# EAGLE design controller (EAGLE 6.1)
Test
DOC_ID: CLK-SCH-03; DOC_PART_NO: CLK-PC-03; DOC_REV: A; DOC_TITLE: CONTROLLER; PROJECT_NAME: ALARM CLOCK

## Sheet 1 of 4: CPU
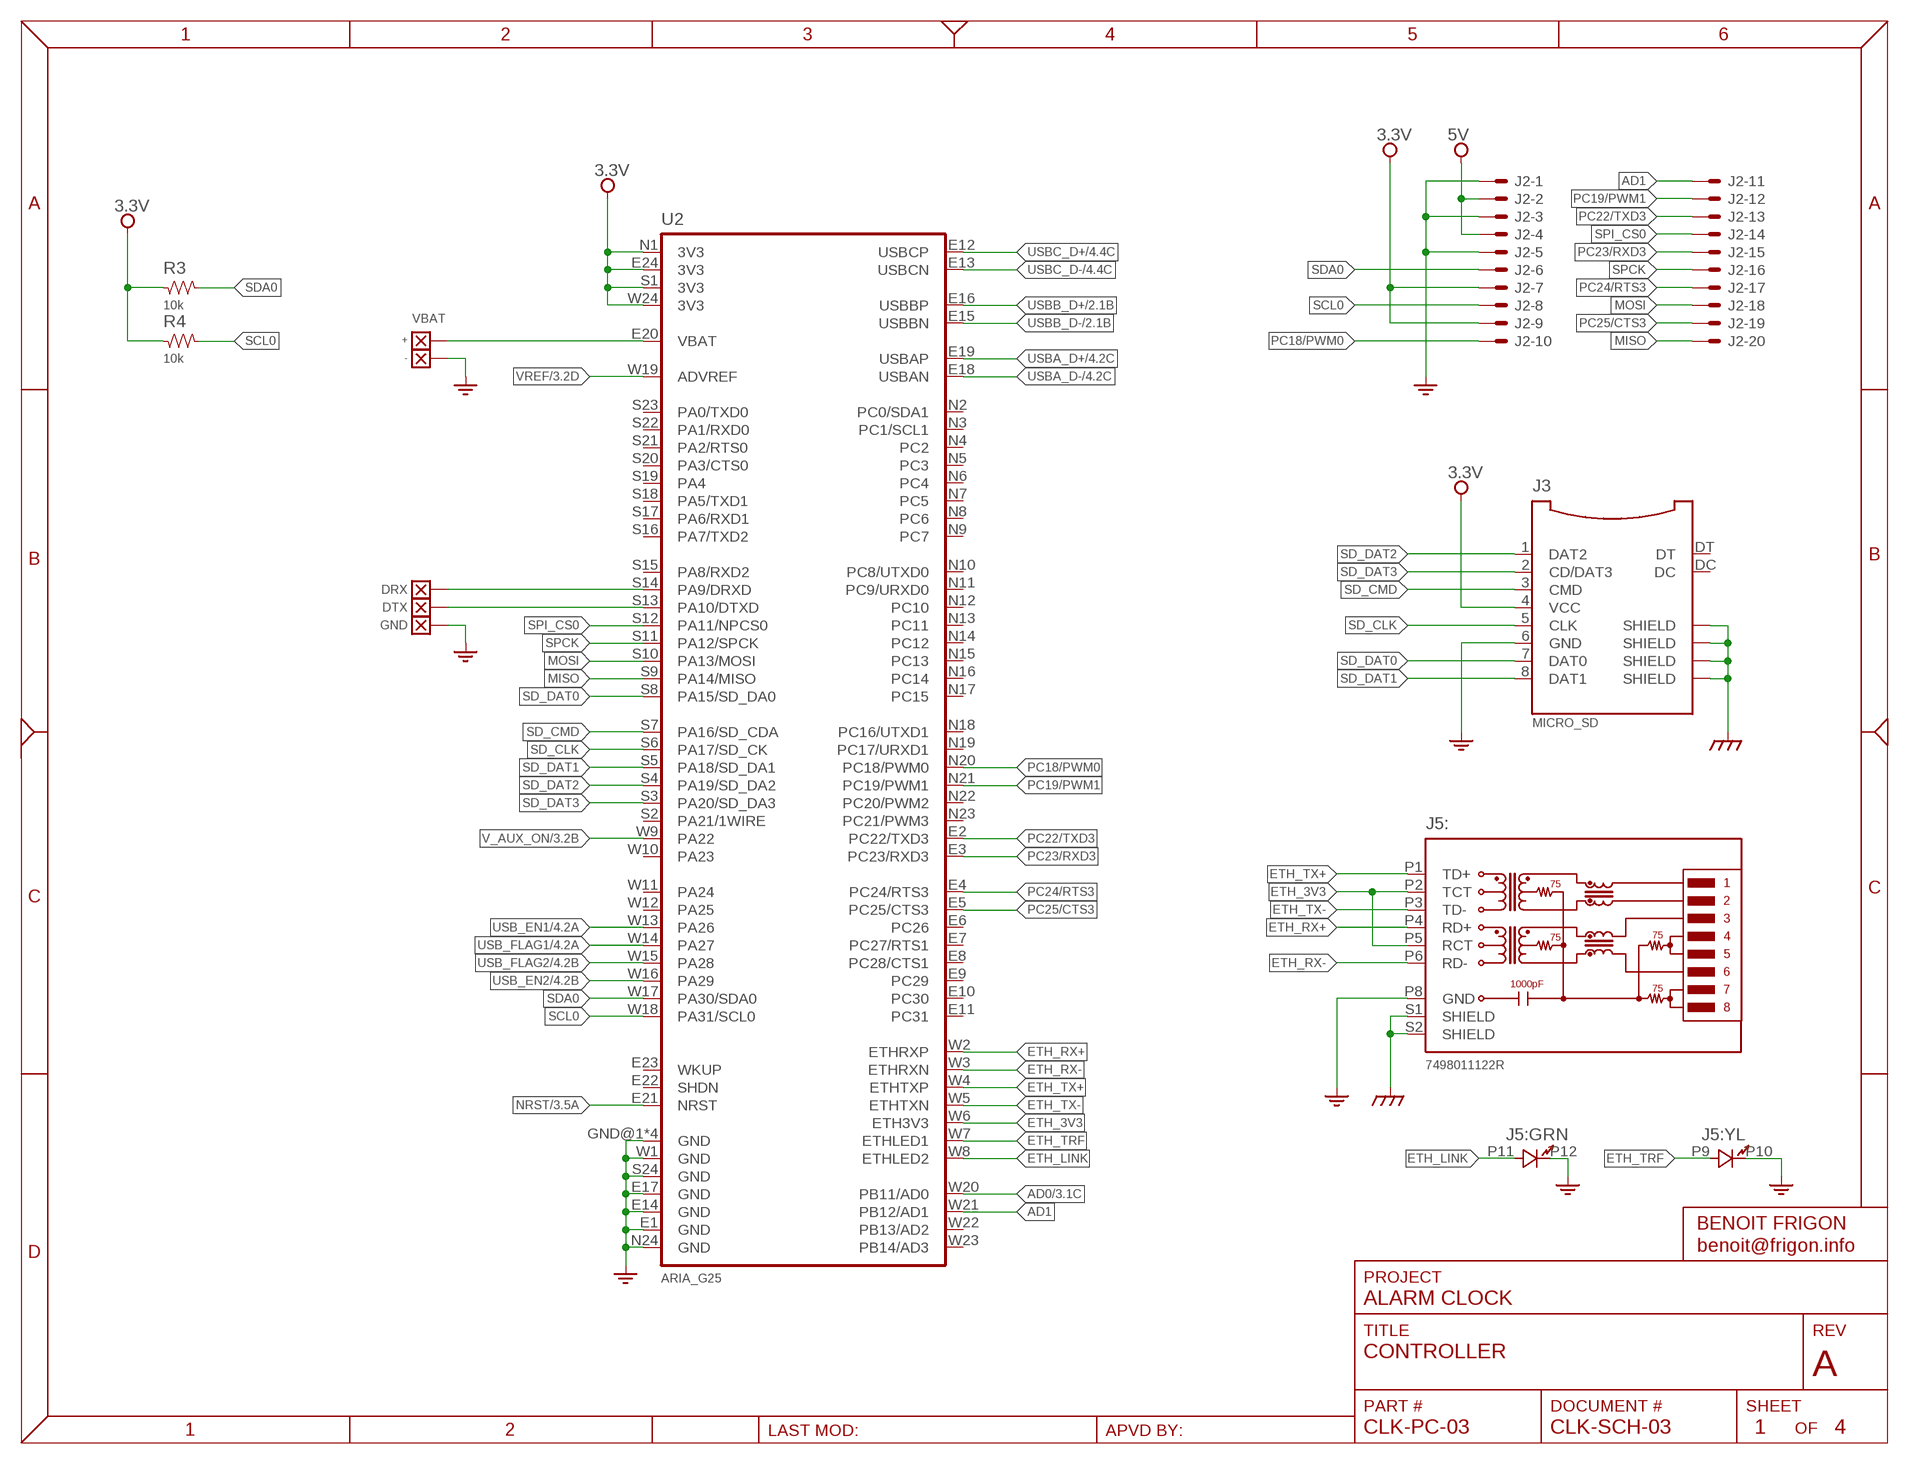
[diagram p0: schematic, sheet 1]

### Parts
J2  DL-1.25MM-HEADER-20  [DF13A-20DP-1.25]
J3  MICRO_SD  [5027020891]
J5  7498011122R  [7498011122R]
R3  10k  RES-0603  [SMD_0603]
R4  10k  RES-0603  [SMD_0603]
TP1  +  WIRE-150X75  [WIRE_SMT_150X75]
TP2  -  WIRE-150X75  [WIRE_SMT_150X75]
U2  ARIA_G25  [ARIA_G25]
W2  DRX  WIRE-150X75  [WIRE_SMT_150X75]
W3  DTX  WIRE-150X75  [WIRE_SMT_150X75]
W4  GND  WIRE-150X75  [WIRE_SMT_150X75]

### Nets
3.3V [Power]: J2.7 J2.9 J3.4(VCC) R3.1 R4.1 U2.E24(3V3) U2.N1(3V3) U2.S1(3V3) U2.W24(3V3) ; also sheet 3,4
5V [Power]: J2.2 J2.4 ; also sheet 2,3,4
AD0: U2.W20(PB11/AD0) ; also sheet 3
AD1: J2.11 U2.W21(PB12/AD1)
DRX: U2.S14(PA9/DRXD) W2.1
DTX: U2.S13(PA10/DTXD) W3.1
EARTH: J3.SHDL@3(SHIELD) J3.SHLD@1(SHIELD) J3.SHLD@2(SHIELD) J3.SHLD@4(SHIELD) J5.S1(::SHIELD) J5.S2(::SHIELD) ; also sheet 3,4
ETH_3V3: J5.P2(::TCT) J5.P5(::RCT) U2.W6(ETH3V3)
ETH_LINK: J5.P11(:GRN:A) U2.W8(ETHLED2)
ETH_RX+: J5.P4(::RD+) U2.W2(ETHRXP)
ETH_RX-: J5.P6(::RD-) U2.W3(ETHRXN)
ETH_TRF: J5.P9(:YL:A) U2.W7(ETHLED1)
ETH_TX+: J5.P1(::TD+) U2.W4(ETHTXP)
ETH_TX-: J5.P3(::TD-) U2.W5(ETHTXN)
GND: J2.1 J2.3 J2.5 J3.6(GND) J5.P8(::GND) J5.P10(:YL:K) J5.P12(:GRN:K) TP2.1 U2.E1(GND) U2.E14(GND) U2.E17(GND) U2.GND@1(GND) U2.GND@2(GND) U2.GND@3(GND) U2.GND@4(GND) U2.N24(GND) U2.S24(GND) U2.W1(GND) W4.1 ; also sheet 2,3,4
MISO: J2.20 U2.S9(PA14/MISO)
MOSI: J2.18 U2.S10(PA13/MOSI)
N$1: TP1.1 U2.E20(VBAT)
NRST: U2.E21(NRST) ; also sheet 3
PC18/PWM0: J2.10 U2.N20(PC18/PWM0)
PC19/PWM1: J2.12 U2.N21(PC19/PWM1)
PC22/TXD3: J2.13 U2.E2(PC22/TXD3)
PC23/RXD3: J2.15 U2.E3(PC23/RXD3)
PC24/RTS3: J2.17 U2.E4(PC24/RTS3)
PC25/CTS3: J2.19 U2.E5(PC25/CTS3)
SCL0: J2.8 R4.2 U2.W18(PA31/SCL0)
SD_CLK: J3.5(CLK) U2.S6(PA17/SD_CK)
SD_CMD: J3.3(CMD) U2.S7(PA16/SD_CDA)
SD_DAT0: J3.7(DAT0) U2.S8(PA15/SD_DA0)
SD_DAT1: J3.8(DAT1) U2.S5(PA18/SD_DA1)
SD_DAT2: J3.1(DAT2) U2.S4(PA19/SD_DA2)
SD_DAT3: J3.2(CD/DAT3) U2.S3(PA20/SD_DA3)
SDA0: J2.6 R3.2 U2.W17(PA30/SDA0)
SPCK: J2.16 U2.S11(PA12/SPCK)
SPI_CS0: J2.14 U2.S12(PA11/NPCS0)
USB_EN1: U2.W13(PA26) ; also sheet 4
USB_EN2: U2.W16(PA29) ; also sheet 4
USB_FLAG1: U2.W14(PA27) ; also sheet 4
USB_FLAG2: U2.W15(PA28) ; also sheet 4
USBA_D+: U2.E19(USBAP) ; also sheet 4
USBA_D-: U2.E18(USBAN) ; also sheet 4
USBB_D+: U2.E16(USBBP) ; also sheet 2
USBB_D-: U2.E15(USBBN) ; also sheet 2
USBC_D+: U2.E12(USBCP) ; also sheet 4
USBC_D-: U2.E13(USBCN) ; also sheet 4
V_AUX_ON: U2.W9(PA22) ; also sheet 3
VREF: U2.W19(ADVREF) ; also sheet 3
Unconnected: J3.DC J3.DT U2.E6(PC26) U2.E7(PC27/RTS1) U2.E8(PC28/CTS1) U2.E9(PC29) U2.E10(PC30) U2.E11(PC31) U2.E22(SHDN) U2.E23(WKUP) U2.N2(PC0/SDA1) U2.N3(PC1/SCL1) U2.N4(PC2) U2.N5(PC3) U2.N6(PC4) U2.N7(PC5) U2.N8(PC6) U2.N9(PC7) U2.N10(PC8/UTXD0) U2.N11(PC9/URXD0) U2.N12(PC10) U2.N13(PC11) U2.N14(PC12) U2.N15(PC13) U2.N16(PC14) U2.N17(PC15) U2.N18(PC16/UTXD1) U2.N19(PC17/URXD1) U2.N22(PC20/PWM2) U2.N23(PC21/PWM3) U2.S2(PA21/1WIRE) U2.S15(PA8/RXD2) U2.S16(PA7/TXD2) U2.S17(PA6/RXD1) U2.S18(PA5/TXD1) U2.S19(PA4) U2.S20(PA3/CTS0) U2.S21(PA2/RTS0) U2.S22(PA1/RXD0) U2.S23(PA0/TXD0) U2.W10(PA23) U2.W11(PA24) U2.W12(PA25) U2.W22(PB13/AD2) U2.W23(PB14/AD3)

### Notes on the sheet
- VBAT

## Sheet 2 of 4: Audio
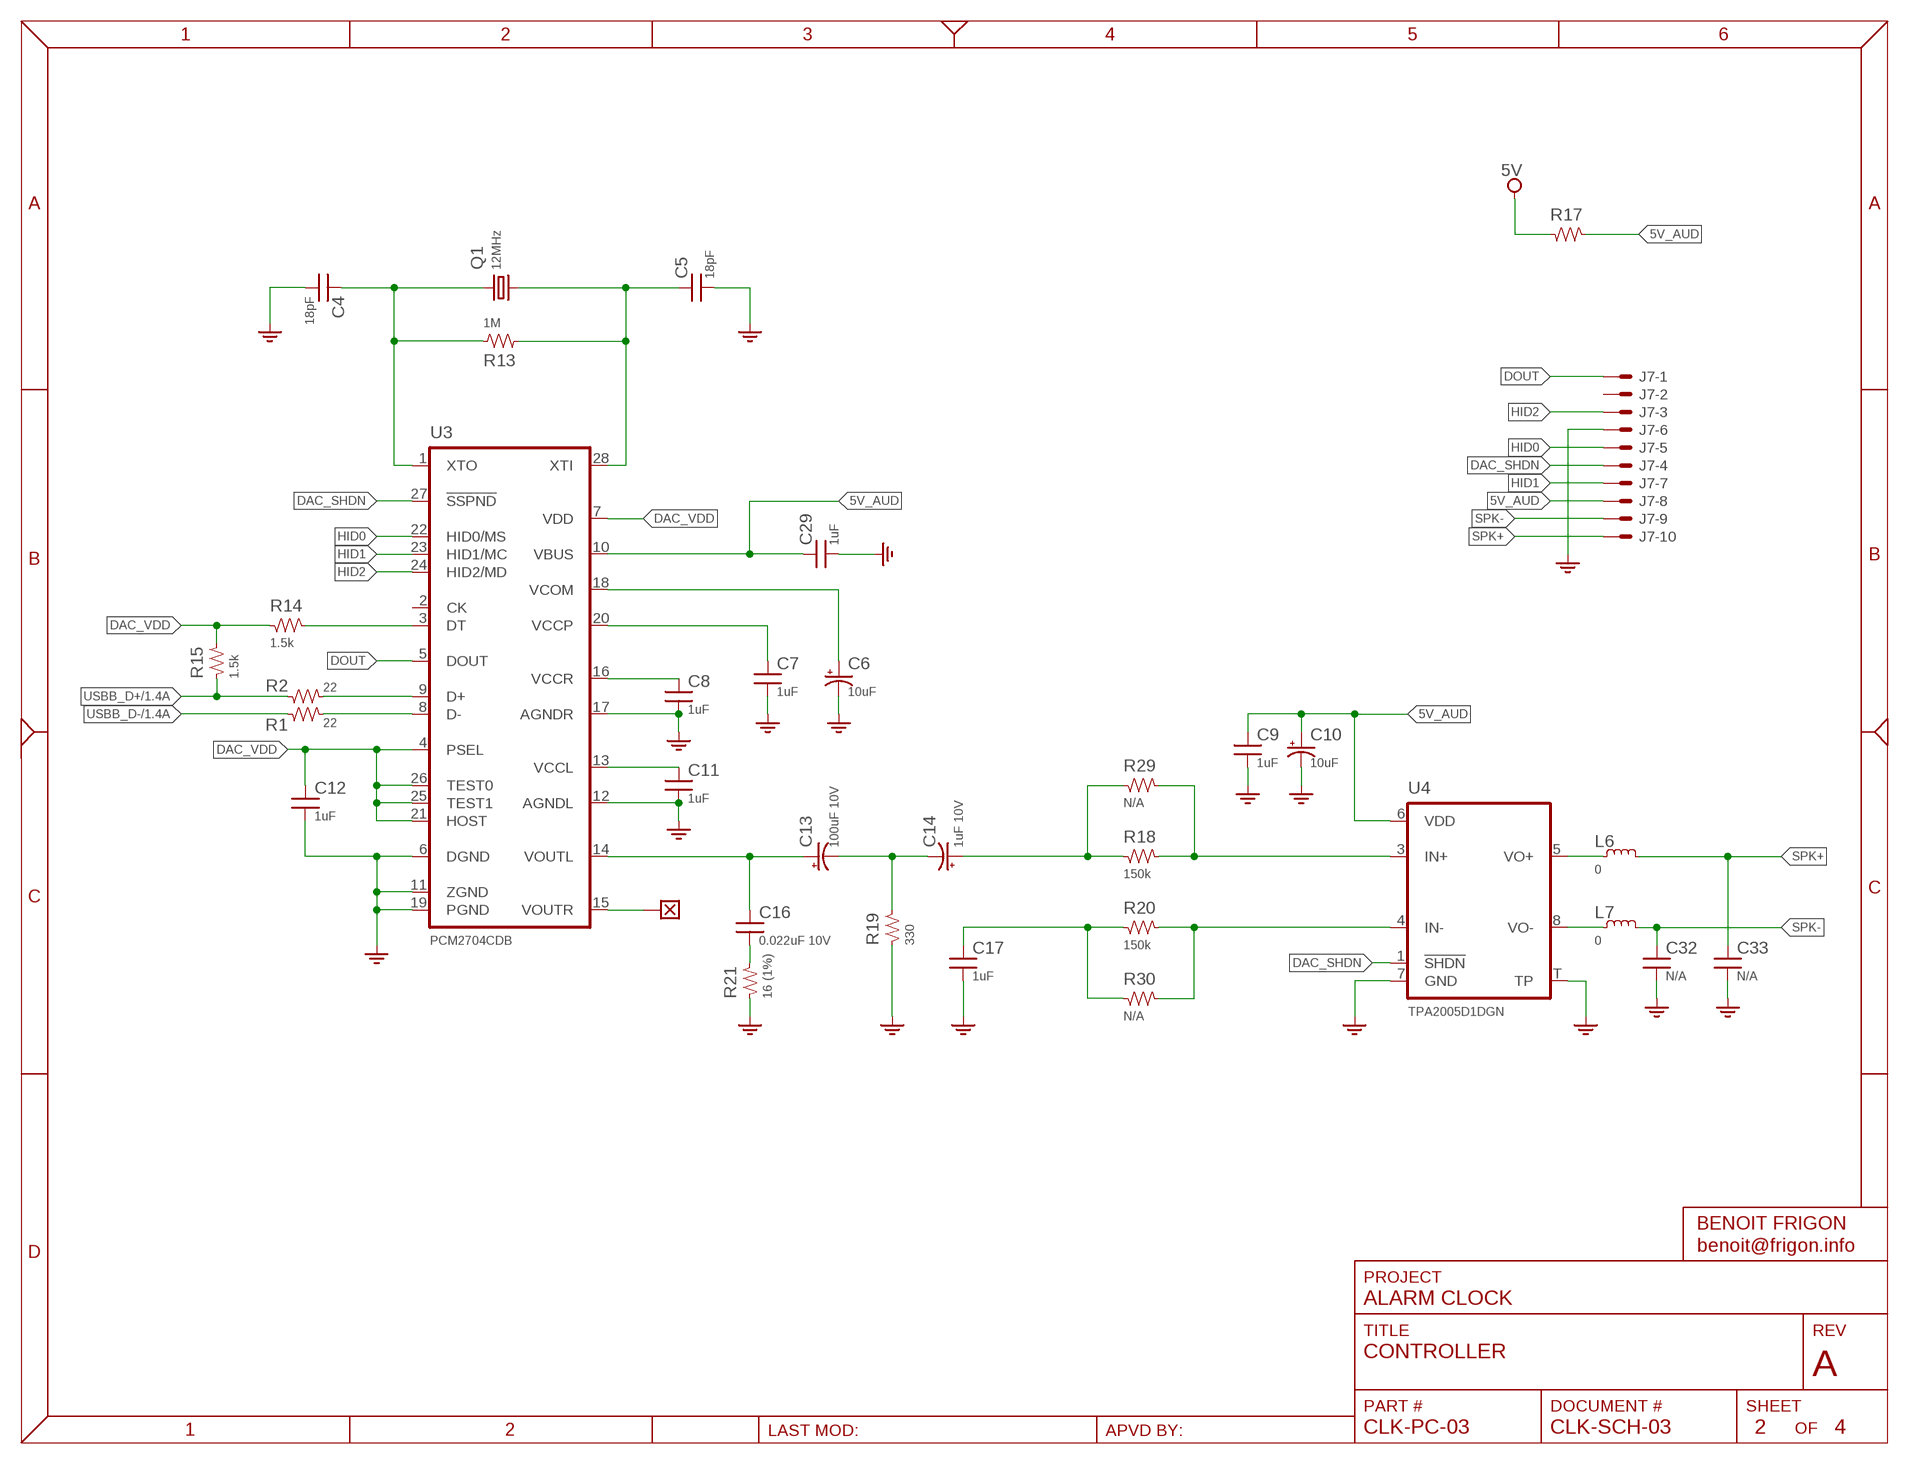
[diagram p1: schematic, sheet 2]
FRAME2 (FRAME_LETTER): SUBTITLE: AUDIO

### Parts
C4  18pF  CAP-0603  [SMD_0603]
C5  18pF  CAP-0603  [SMD_0603]
C6  10uF  CAP-E-0805-ALUM  [CAP_S0805]
C7  1uF  CAP-0603  [SMD_0603]
C8  1uF  CAP-0603  [SMD_0603]
C9  1uF  CAP-0603  [SMD_0603]
C10  10uF  CAP-E-0805-ALUM  [CAP_S0805]
C11  1uF  CAP-0603  [SMD_0603]
C12  1uF  CAP-0603  [SMD_0603]
C13  100uF 10V  CAP-E-1210-ALUM  [CAP_S1210]
C14  1uF 10V  CAP-E-0805-ALUM  [CAP_S0805]
C16  0.022uF 10V  CAP-0603  [SMD_0603]
C17  1uF  CAP-0603  [SMD_0603]
C29  1uF  CAP-0603  [SMD_0603]
C32  N/A  CAP-0603  [SMD_0603]
C33  N/A  CAP-0603  [SMD_0603]
J7  DL-1.25MM-HEADER-10  [DF13A-10DP-1.25]
L6  0  IND-0603  [SMD_0603]
L7  0  IND-0603  [SMD_0603]
Q1  12MHz  XTALHC49UP  [HC49UP]
R1  22  RES-0603  [SMD_0603]
R2  22  RES-0603  [SMD_0603]
R13  1M  RES-0603  [SMD_0603]
R14  1.5k  RES-0603  [SMD_0603]
R15  1.5k  RES-0603  [SMD_0603]
R17  RES-1206  [SMD_1206]
R18  150k  RES-0603  [SMD_0603]
R19  330  RES-0603  [SMD_0603]
R20  150k  RES-0603  [SMD_0603]
R21  16 (1%)  RES-0603  [SMD_0603]
R29  N/A  RES-0603  [SMD_0603]
R30  N/A  RES-0603  [SMD_0603]
U3  PCM2704CDB  [SSOP28]
U4  TPA2005D1DGN  [PPSOP8]
W1  WIRE-150X75  [WIRE_SMT_150X75]

### Nets
5V [Power]: R17.1 ; also sheet 1,3,4
5V_AUD: C9.1 C10.+ C29.1 J7.8 R17.2 U3.10(VBUS) U4.6(VDD)
DAC_SHDN: J7.4 U3.27(!SSPND) U4.1(!SHDN)
DAC_VDD: C12.1 R14.1 R15.2 U3.4(PSEL) U3.7(VDD) U3.21(HOST) U3.25(TEST1) U3.26(TEST0)
DOUT: J7.1 U3.5(DOUT)
GND: C4.2 C5.2 C6.- C7.2 C8.2 C9.2 C10.- C11.2 C12.2 C17.2 C29.2 C32.2 C33.2 J7.6 R19.1 R21.1 U3.6(DGND) U3.11(ZGND) U3.12(AGNDL) U3.17(AGNDR) U3.19(PGND) U4.7(GND) U4.T(TP) ; also sheet 1,3,4
HID0: J7.5 U3.22(HID0/MS)
HID1: J7.7 U3.23(HID1/MC)
HID2: J7.3 U3.24(HID2/MD)
N$12: R2.2 U3.9(D+)
N$13: R1.2 U3.8(D-)
N$14: C11.1 U3.13(VCCL)
N$15: C6.+ U3.18(VCOM)
N$16: C7.1 U3.20(VCCP)
N$17: C8.1 U3.16(VCCR)
N$18: C14.+ R18.1 R29.1
N$19: R14.2 U3.3(DT)
N$20: U3.15(VOUTR) W1.1
N$24: L6.1 U4.5(VO+)
N$25: L7.1 U4.8(VO-)
N$26: R18.2 R29.2 U4.3(IN+)
N$27: R20.2 R30.2 U4.4(IN-)
N$28: C17.1 R20.1 R30.1
N$29: C13.- C14.- R19.2
N$31: C16.2 R21.2
SPK+: C33.1 J7.10 L6.2
SPK-: C32.1 J7.9 L7.2
USBB_D+: R2.1 R15.1 ; also sheet 1
USBB_D-: R1.1 ; also sheet 1
VOUTL: C13.+ C16.1 U3.14(VOUTL)
XTI: C5.1 Q1.2 R13.2 U3.28(XTI)
XTO: C4.1 Q1.1 R13.1 U3.1(XTO)
Unconnected: J7.2 U3.2(CK)

## Sheet 3 of 4: Power supply
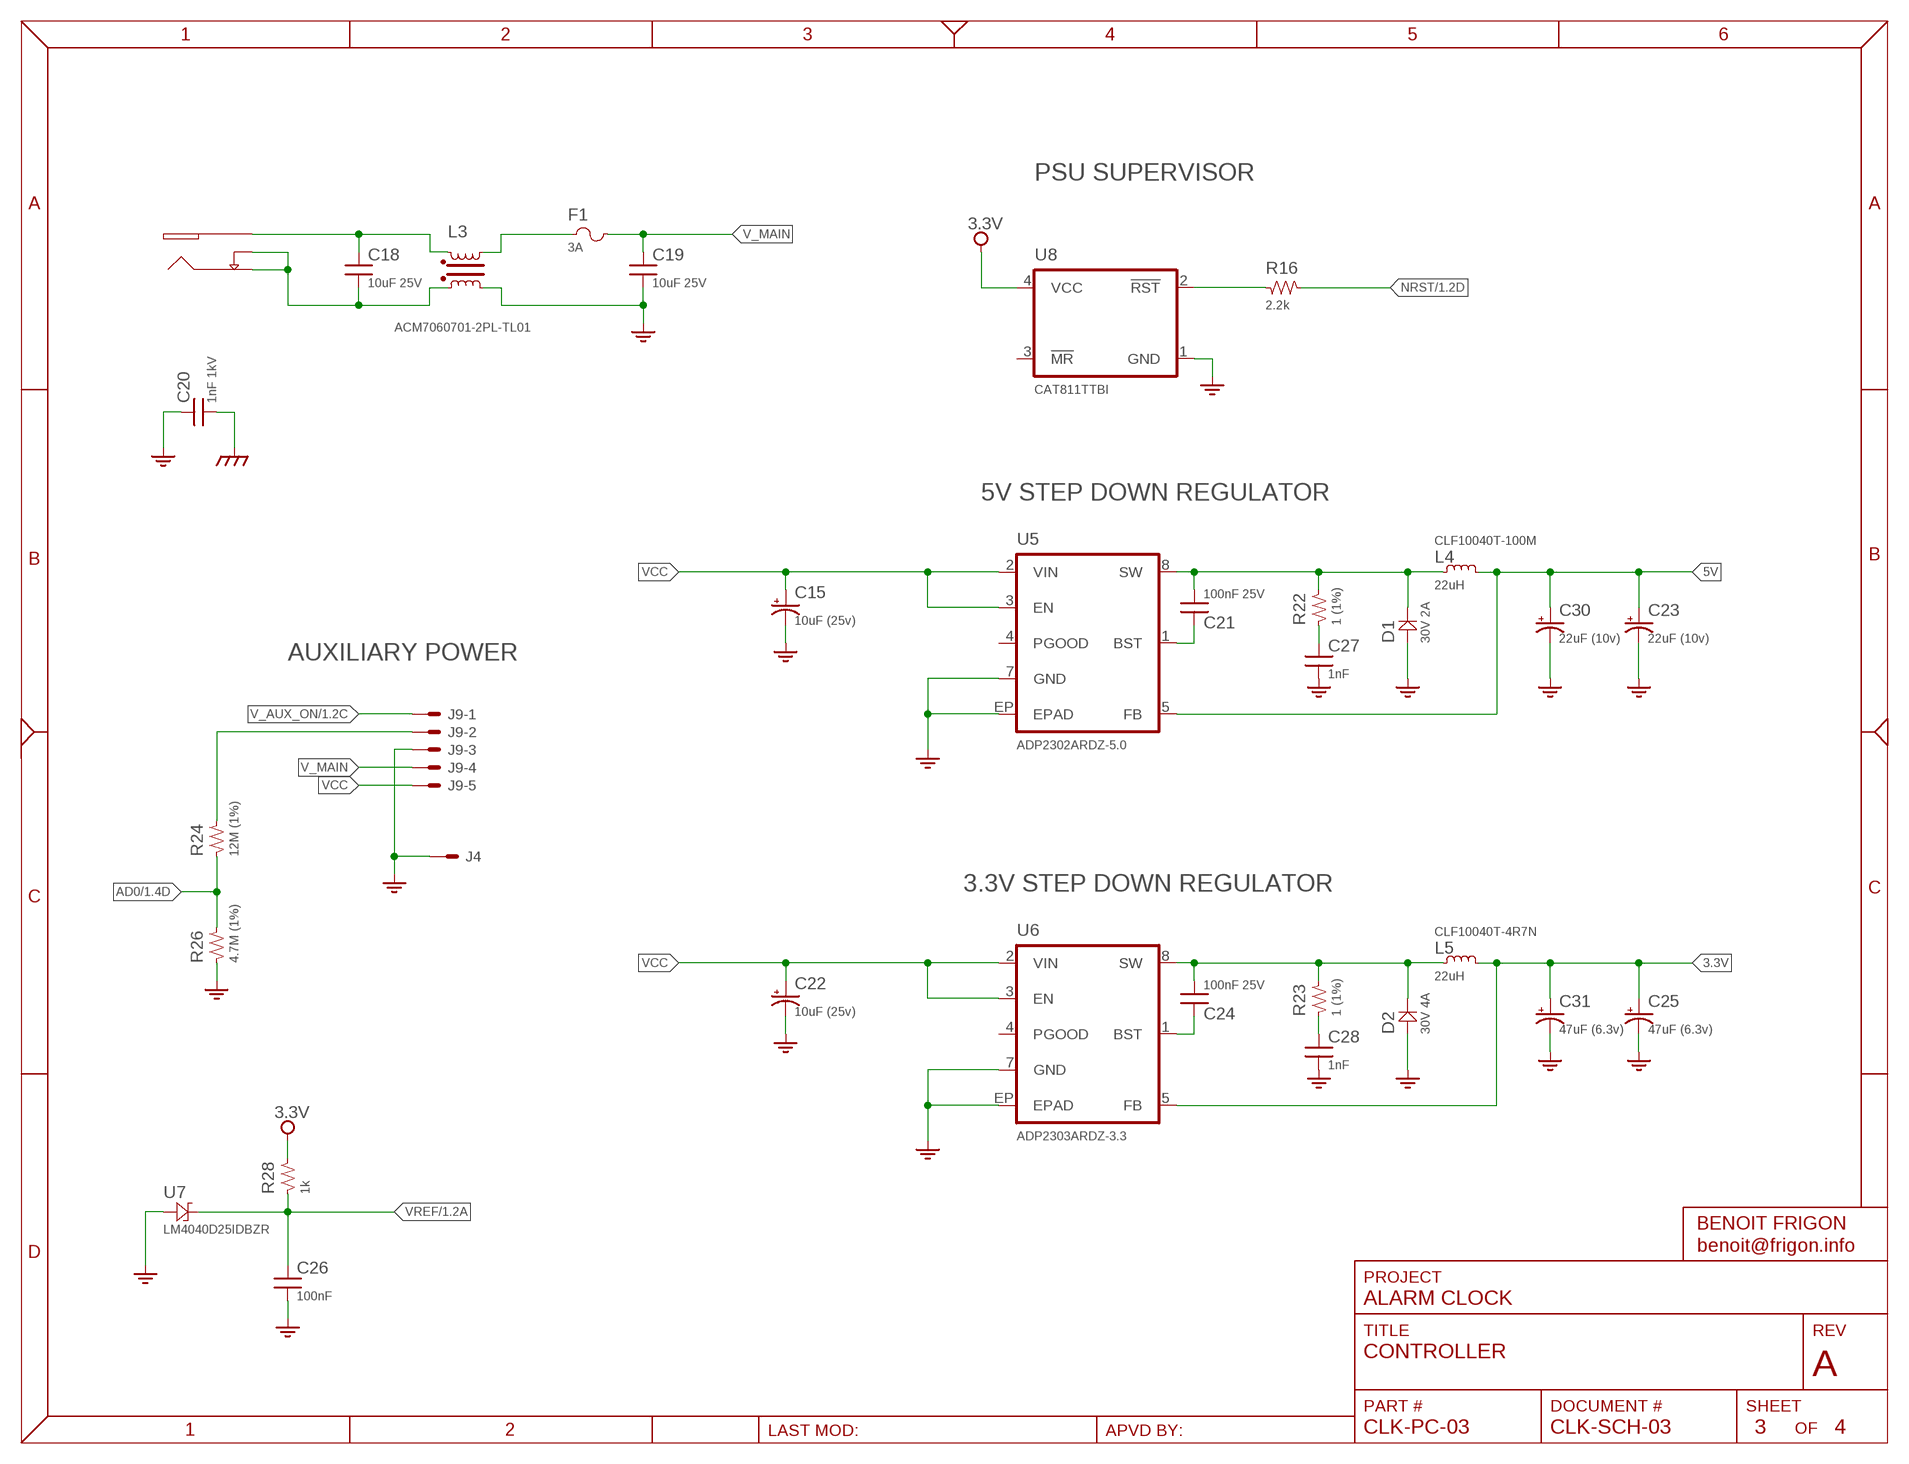
[diagram p2: schematic, sheet 3]
FRAME3 (FRAME_LETTER): SUBTITLE: POWER SUPPLY

### Parts
C15  10uF (25v)  CAP-E-1210-TANT  [CAP_S1210]
C18  10uF 25V  CAP-1206  [SMD_1206]
C19  10uF 25V  CAP-1206  [SMD_1206]
C20  1nF 1kV  CAP-0805  [SMD_0805]
C21  100nF 25V  CAP-0603  [SMD_0603]
C22  10uF (25v)  CAP-E-1210-TANT  [CAP_S1210]
C23  22uF (10v)  CAP-E-1206-TANT  [CAP_S1206]
C24  100nF 25V  CAP-0603  [SMD_0603]
C25  47uF (6.3v)  CAP-E-1206-TANT  [CAP_S1206]
C26  100nF  CAP-0603  [SMD_0603]
C27  1nF  CAP-0805  [SMD_0805]
C28  1nF  CAP-0805  [SMD_0805]
C30  22uF (10v)  CAP-E-1206-TANT  [CAP_S1206]
C31  47uF (6.3v)  CAP-E-1206-TANT  [CAP_S1206]
D1  30V 2A  DIODE-DO214-AA  [DIODE_DO214-AA]
D2  30V 4A  DIODE-DO214-AA  [DIODE_DO214-AA]
F1  3A  FUSE1206  [SMD_1206]
J4  SNG-100-HEADER-01-HDR-V  [HDR_M_1]
J8  CUI-PJ-013C  [CUI-PJ-013C]
J9  SNG-100-HEADER-05-HDR-V  [HDR_M_5]
L3  ACM7060701-2PL-TL01  CHOKE-ACM7060701-2PL-TL01  [ACM7060]
L4  22uH  IND-10X10  [IND-10X10]
L5  22uH  IND-10X10  [IND-10X10]
R16  2.2k  RES-0603  [SMD_0603]
R22  1 (1%)  RES-0805  [SMD_0805]
R23  1 (1%)  RES-0805  [SMD_0805]
R24  12M (1%)  RES-0603  [SMD_0603]
R26  4.7M (1%)  RES-0603  [SMD_0603]
R28  1k  RES-0603  [SMD_0603]
U5  ADP2302ARDZ-5.0  [SOIC8-EP]
U6  ADP2303ARDZ-3.3  [SOIC8-EP]
U7  LM4040D25IDBZR  TS4040D30IDBZ  [SOT23]
U8  CAT811TTBI  [SOT143]

### Nets
3.3V [Power]: C25.+ C31.+ L5.2 R28.2 U6.5(FB) U8.4(VCC) ; also sheet 1,4
5V [Power]: C23.+ C30.+ L4.2 U5.5(FB) ; also sheet 1,2,4
AD0: R24.1 R26.2 ; also sheet 1
EARTH: C20.2 ; also sheet 1,4
GND: C15.- C19.2 C20.1 C22.- C23.- C25.- C26.2 C27.2 C28.2 C30.- C31.- D1.A D2.A J4.1(S) J9.3 L3.OA R26.1 U5.7(GND) U5.EP(EPAD) U6.7(GND) U6.EP(EPAD) U7.2(A) U8.1(GND) ; also sheet 1,2,4
IN_GND: C18.2 J8.2(GND) J8.3(SW) L3.IA
N$2: C27.1 R22.1
N$3: C28.1 R23.1
N$4: C18.1 J8.1(V+) L3.IB
N$11: C21.1 U5.1(BST)
N$21: R16.1 U8.2(!RST)
N$32: F1.1 L3.OB
N$36: C24.1 U6.1(BST)
NRST: R16.2 ; also sheet 1
SW_3.3: C24.2 D2.K L5.1 R23.2 U6.8(SW)
SW_5V: C21.2 D1.K L4.1 R22.2 U5.8(SW)
V_AUX_MON: J9.2 R24.2
V_AUX_ON: J9.1 ; also sheet 1
V_MAIN: C19.1 F1.2 J9.4
VCC: C15.+ C22.+ J9.5 U5.2(VIN) U5.3(EN) U6.2(VIN) U6.3(EN)
VREF: C26.1 R28.1 U7.1(K) ; also sheet 1
Unconnected: U5.4(PGOOD) U6.4(PGOOD) U8.3(!MR)

### Notes on the sheet
- PSU SUPERVISOR
- 5V STEP DOWN REGULATOR
- AUXILIARY POWER
- 3.3V STEP DOWN REGULATOR

## Sheet 4 of 4: USB
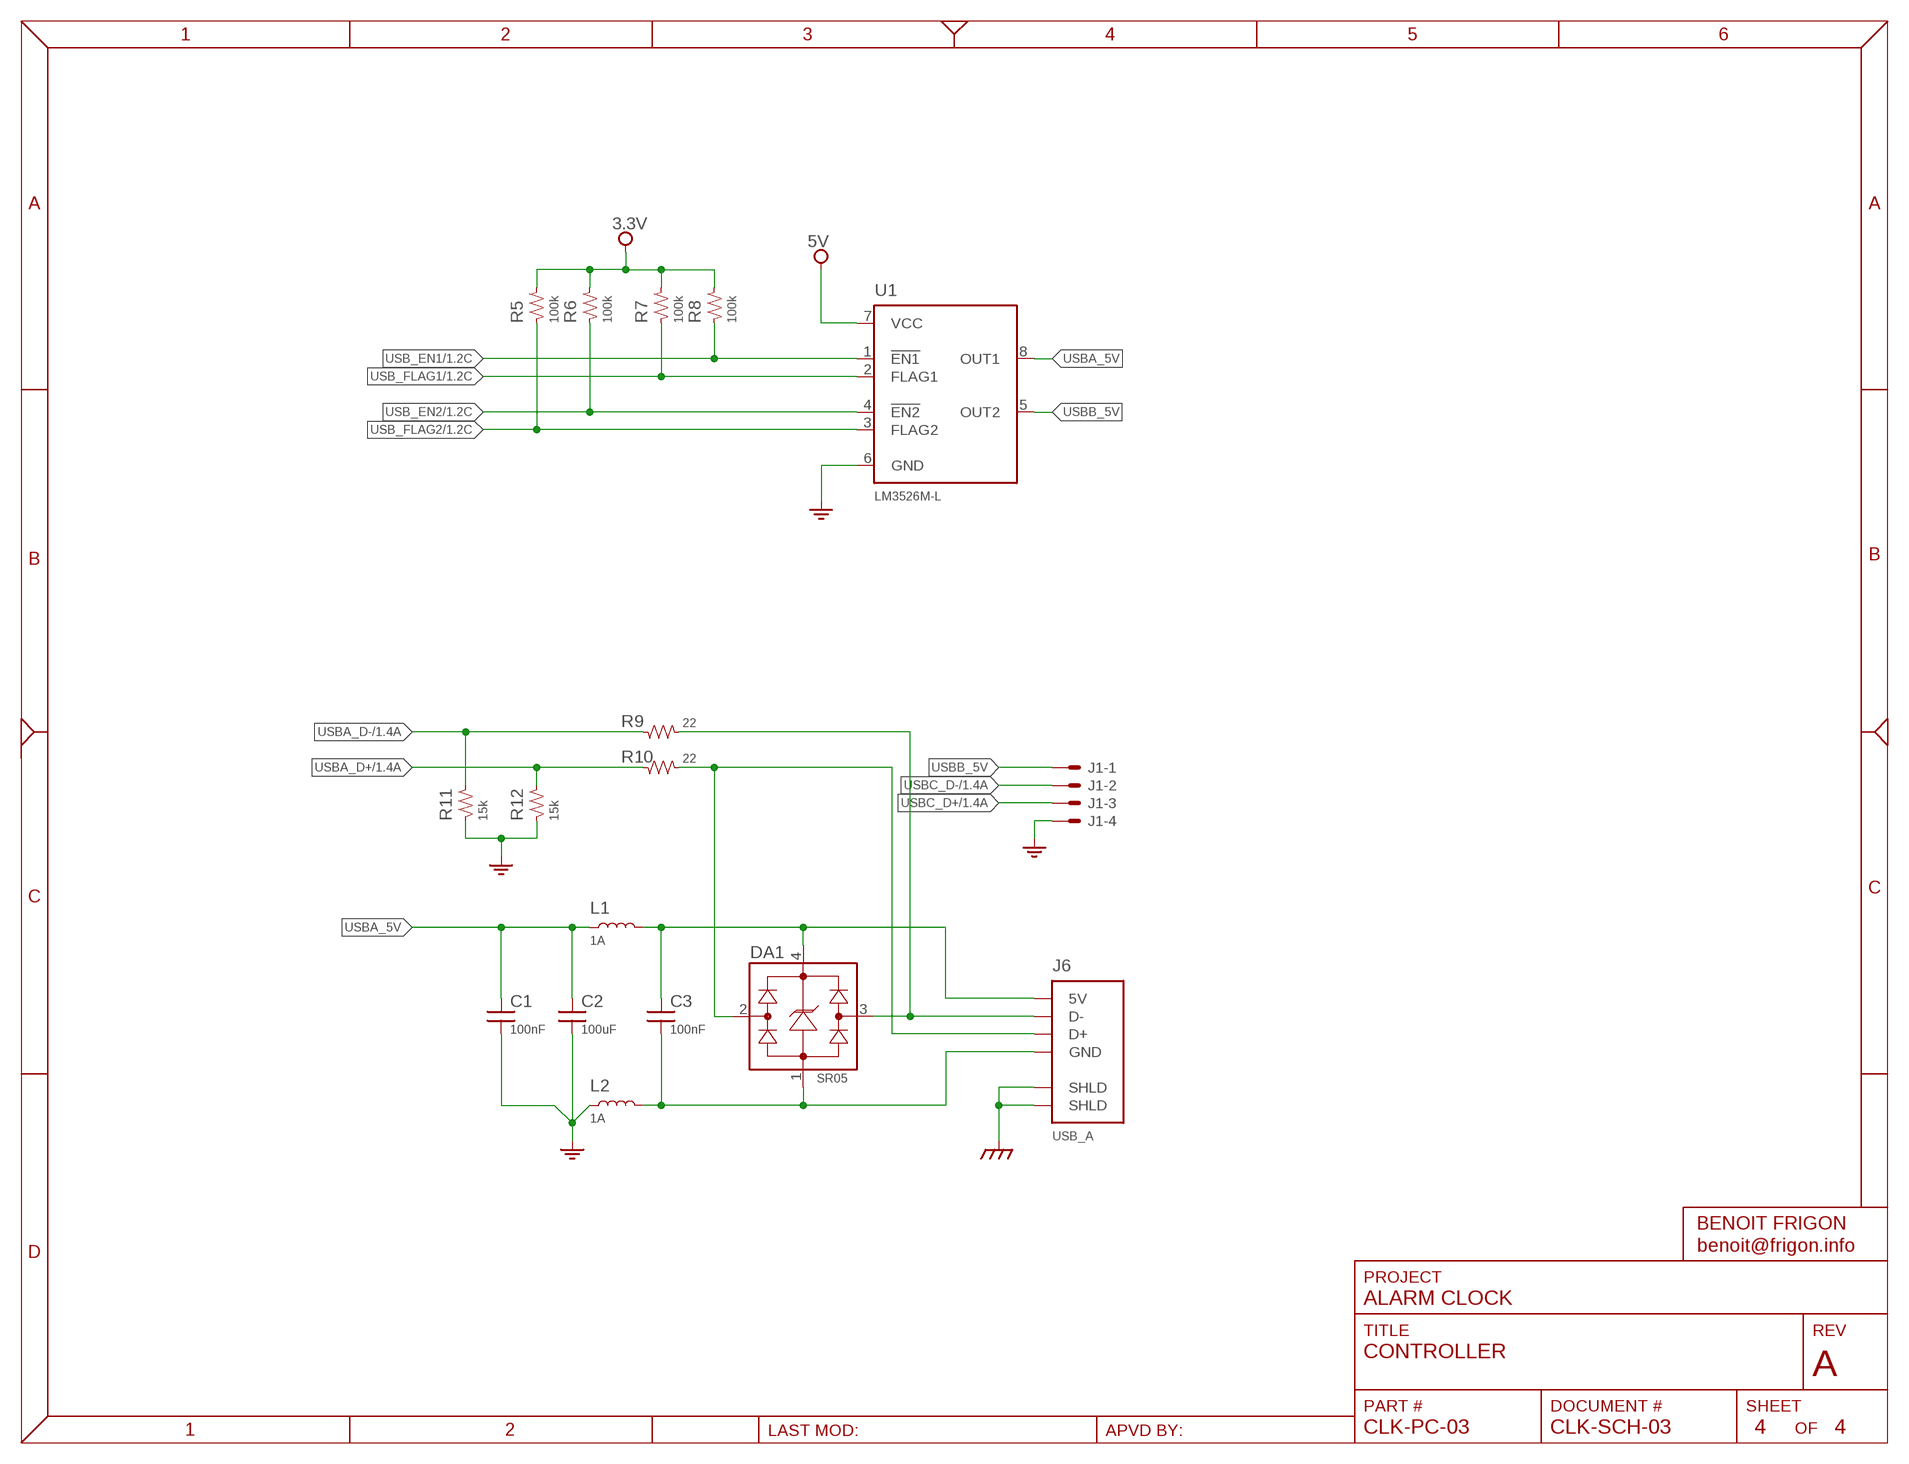
[diagram p3: schematic, sheet 4]

### Parts
C1  100nF  CAP-0603  [SMD_0603]
C2  100uF  CAP-0805  [SMD_0805]
C3  100nF  CAP-0603  [SMD_0603]
DA1  SR05  [SOT143]
J1  SNG-2MM-HEADER-04-V  [DF3X-4P-2DSA]
J6  USB_A  [292303-7]
L1  1A  FERRITE  [SMD_0805]
L2  1A  FERRITE  [SMD_0805]
R5  100k  RES-0603  [SMD_0603]
R6  100k  RES-0603  [SMD_0603]
R7  100k  RES-0603  [SMD_0603]
R8  100k  RES-0603  [SMD_0603]
R9  22  RES-0603  [SMD_0603]
R10  22  RES-0603  [SMD_0603]
R11  15k  RES-0603  [SMD_0603]
R12  15k  RES-0603  [SMD_0603]
U1  LM3526M-L  [SOIC8]

### Nets
3.3V [Power]: R5.2 R6.2 R7.2 R8.2 ; also sheet 1,3
5V [Power]: U1.7(VCC) ; also sheet 1,2,3
EARTH: J6.SHLD@1(SHLD) J6.SHLD@2(SHLD) ; also sheet 1,3
GND: C1.2 C2.2 J1.4 L2.1 R11.1 R12.1 U1.6(GND) ; also sheet 1,2,3
N$5: C3.1 DA1.4 J6.1(5V) L1.2
N$6: C3.2 DA1.1 J6.4(GND) L2.2
N$7: DA1.3 J6.2(D-) R9.2
N$8: DA1.2 J6.3(D+) R10.2
USB_EN1: R8.1 U1.1(!EN1) ; also sheet 1
USB_EN2: R6.1 U1.4(!EN2) ; also sheet 1
USB_FLAG1: R7.1 U1.2(FLAG1) ; also sheet 1
USB_FLAG2: R5.1 U1.3(FLAG2) ; also sheet 1
USBA_5V: C1.1 C2.1 L1.1 U1.8(OUT1)
USBA_D+: R10.1 R12.2 ; also sheet 1
USBA_D-: R9.1 R11.2 ; also sheet 1
USBB_5V: J1.1 U1.5(OUT2)
USBC_D+: J1.3 ; also sheet 1
USBC_D-: J1.2 ; also sheet 1

## Library data of the parts
C1 C3-C5 C7-C9 C11 C12 C16 C17 C21 C24 C26 C29 C32 C33 = Passive:CAP: Capacitor; DESCRIPTION: {DESCRIPTION} - SMT 0603 - {value}; PACKAGE: SMT 0603
C2 C20 C27 C28 = Passive:CAP: Capacitor; DESCRIPTION: {DESCRIPTION} - SMT 0805 - {value}; PACKAGE: SMT 0805
C6 C10 C14 = Passive:CAP-E-?-*: Capacitor; DESCRIPTION: Aluminium capacitor - SMT 0805 - {VALUE}
C13 = Passive:CAP-E-?-*: Capacitor; DESCRIPTION: Aluminium capacitor - SMT 1210 - {VALUE}; MFG: AVX
C15 C22 = Passive:CAP-E-?-*: Capacitor; DESCRIPTION: Tantalum capacitor - SMT 1210 - {VALUE}; MFG: AVX; PART_NO: TPSB106K025R1800
C18 C19 = Passive:CAP: Capacitor; DESCRIPTION: {DESCRIPTION} - SMT 1206 - {value}; PACKAGE: SMT 1206
C23 C30 = Passive:CAP-E-?-*: Capacitor; DESCRIPTION: Tantalum capacitor - SMT 1206 - {VALUE}; MFG: AVX; PART_NO: TPSA226M010R0900
C25 C31 = Passive:CAP-E-?-*: Capacitor; DESCRIPTION: Tantalum capacitor - SMT 1206 - {VALUE}; MFG: AVX; PART_NO: TPSA476K006R0800
D1 D2 = Passive:DIODE: Diode
DA1 = Passive:SR05: TVS Array 2-Line - 5V; MFG: Semtech; SKU: SR05.TCT
F1 = Passive:FUSE: Fuse; DESCRIPTION: {DESCRIPTION} - SMT 1206 - {VALUE}
J1 = Connectors:SNG-2MM-HEADER-04: 2mm Single Row Header - 4 pos; DESCRIPTION: {DESCRIPTION} - Vertical; MFG: Hirose Electronic; SKU: DF3A-4P-2DSA
J2 = Connectors:DL-1.25MM-HEADER-20
J3 = Connectors:MICRO_SD
J4 = Connectors:SNG-100-HEADER-01: 1 Pos - 2.54mm header
J5 = Connectors:7498011122R
J6 = Connectors:USB_A
J7 = Connectors:DL-1.25MM-HEADER-10
J8 = Connectors:CUI-PJ-013C
J9 = Connectors:SNG-100-HEADER-05: 5 Pos - Single Row - 2.54mm header; DESCRIPTION: {DESCRIPTION} - Male - Vertical
L1 L2 = Passive:FERRITE: Ferrite; DESCRIPTION: {DESCRIPTION} - SMT 0805 - {VALUE}
L3 = Passive:CHOKE-?*: Common mode choke; DESCRIPTION: {DESCRIPTION} - 4A; SKU: ACM7060-701-2PL-TL01
L4 = Passive:IND?*: Inductor; DESCRIPTION: {DESCRIPTION} - SMT 10x10mm - {VALUE}; MFG: TDK; PART_NO: CLF10040T-100M
L5 = Passive:IND?*: Inductor; DESCRIPTION: {DESCRIPTION} - SMT 10x10mm - {VALUE}; PART_NO: CLF10040T-4R7N
L6 L7 = Passive:IND?*: Inductor; DESCRIPTION: {DESCRIPTION} - SMT 0603 - {VALUE}
Q1 = Crystal:XTAL: Crystal
R1-R16 R18-R21 R24 R26 R28-R30 = Passive:RES: Resistor; DESCRIPTION: {DESCRIPTION} - SMT 0603 - {VALUE}; PACKAGE: SMT 0603
R17 = Passive:RES: Resistor; DESCRIPTION: {DESCRIPTION} - SMT 1206 - {VALUE}; PACKAGE: SMT 1206
R22 R23 = Passive:RES: Resistor; DESCRIPTION: {DESCRIPTION} - SMT 0805 - {VALUE}; PACKAGE: SMT 0805
TP1 TP2 W1-W4 = Misc:WIRE-?: Wire solder pad; BOM: FALSE
U1 = Power:LM3526?-*: Dual Port USB Power Switch and Over-Current Protection Features Compatible with USB1.1 and USB 2.0 1 ms fault flag delay filters Hot-Plug events Smooth turn-on eliminates in-rush induced voltage drop UL recognized component: REF# 205202 1A nominal short circuit output current protects PC power supplies Thermal shutdown protects device in direct short condition 500mA minimum continuous load current Small SO-8 package minimizes board space 2.7V to 5.5V input voltage range 140 m? Max. switch resistance 1 ?A Max. standby current 200 ?A Max. operating current Under-voltage lockout (UVLO); DESCRIPTION: Dual Port USB Power Switch and Over-Current Protection (Active Low); MFG: National Semiconductors
U2 = IC:ARIA_G25: ARM SoM 400MHz
U3 = IC:PCM2704C
U4 = IC:TPA2005D1?
U5 = Power:ADP230?: Step-Down Regulator; DESCRIPTION: {DESCRIPTION} - 2A, 5V; MFG: Analog Devices
U6 = Power:ADP230?: Step-Down Regulator; DESCRIPTION: {DESCRIPTION} - 3A, 3.3v; MFG: Analog Devices
U7 = Passive:TS4040; PART_NO: LM4040D25IDBZR
U8 = IC:CAT811*?: Microprocessor power supply supervisor; DESCRIPTION: {DESCRIPTION} - 3.08V threshold; MFG: ON Semiconductors; THRESHOLD: 3.08V

## Net classes
1 Power: width 0.406 mm, drill 0.457 mm, clearance 0.203 mm

## Board
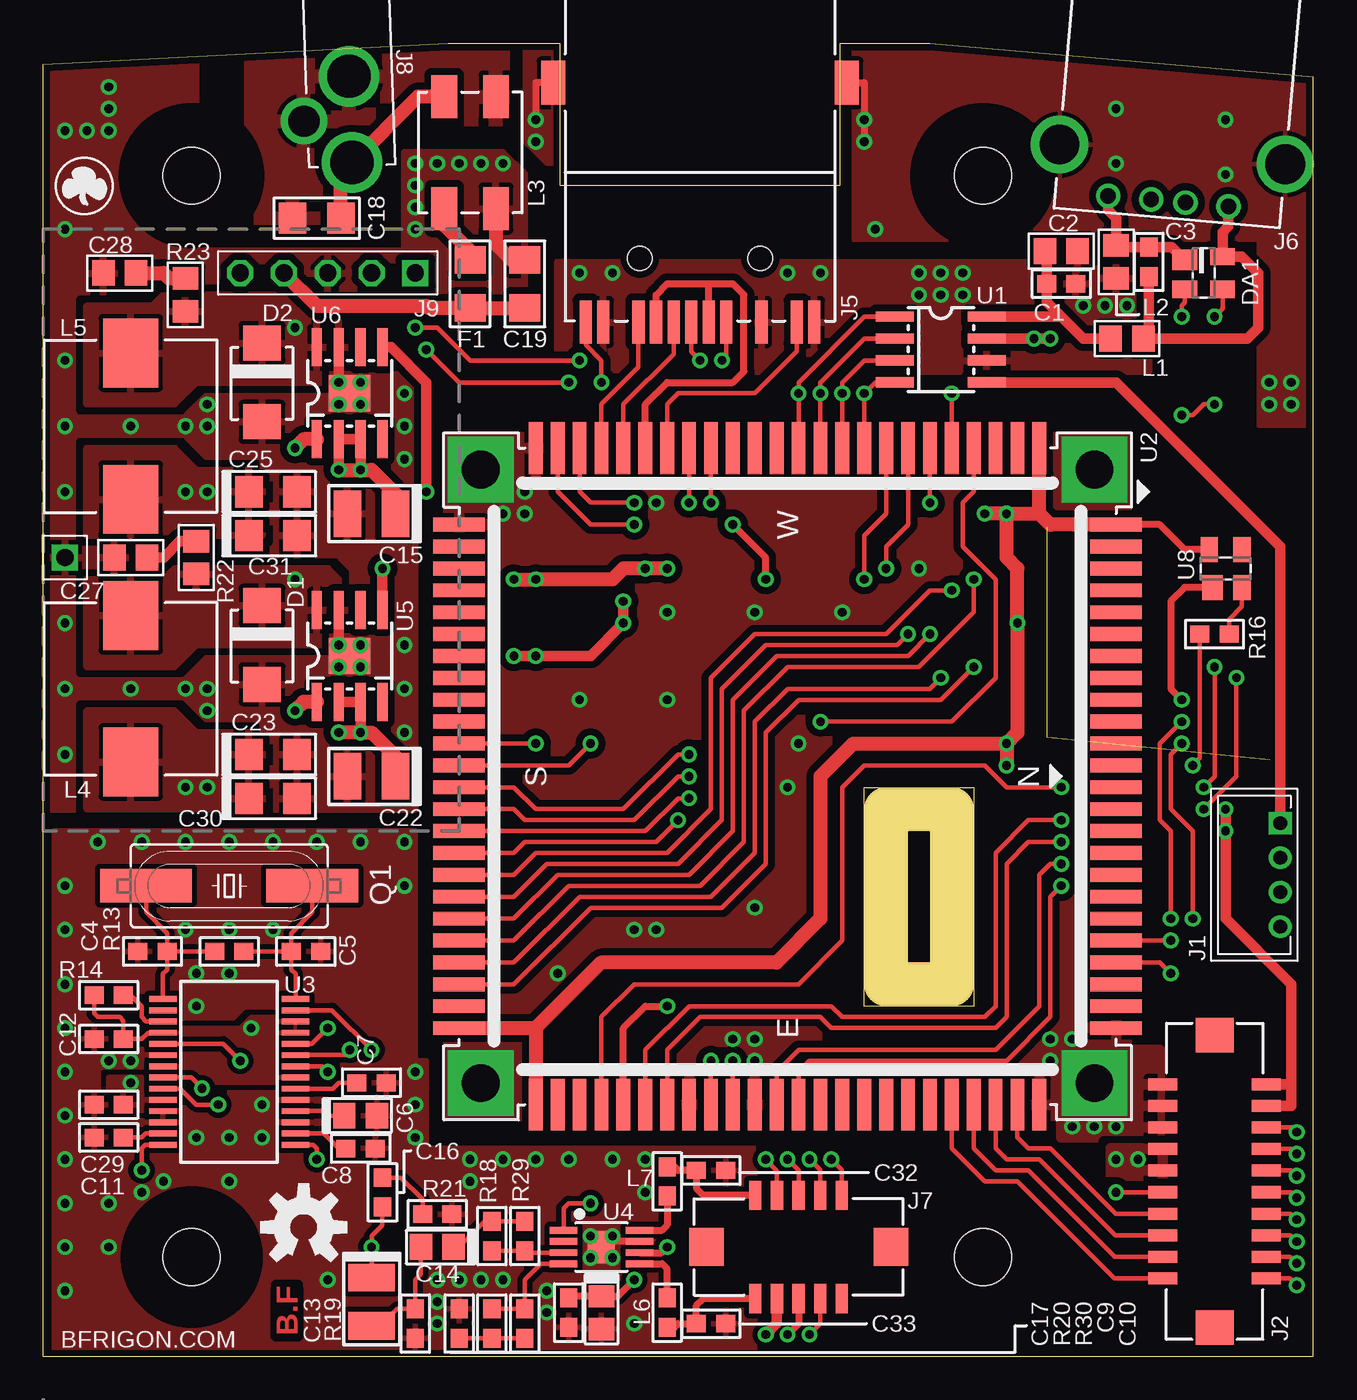
[diagram p4: board, top side]
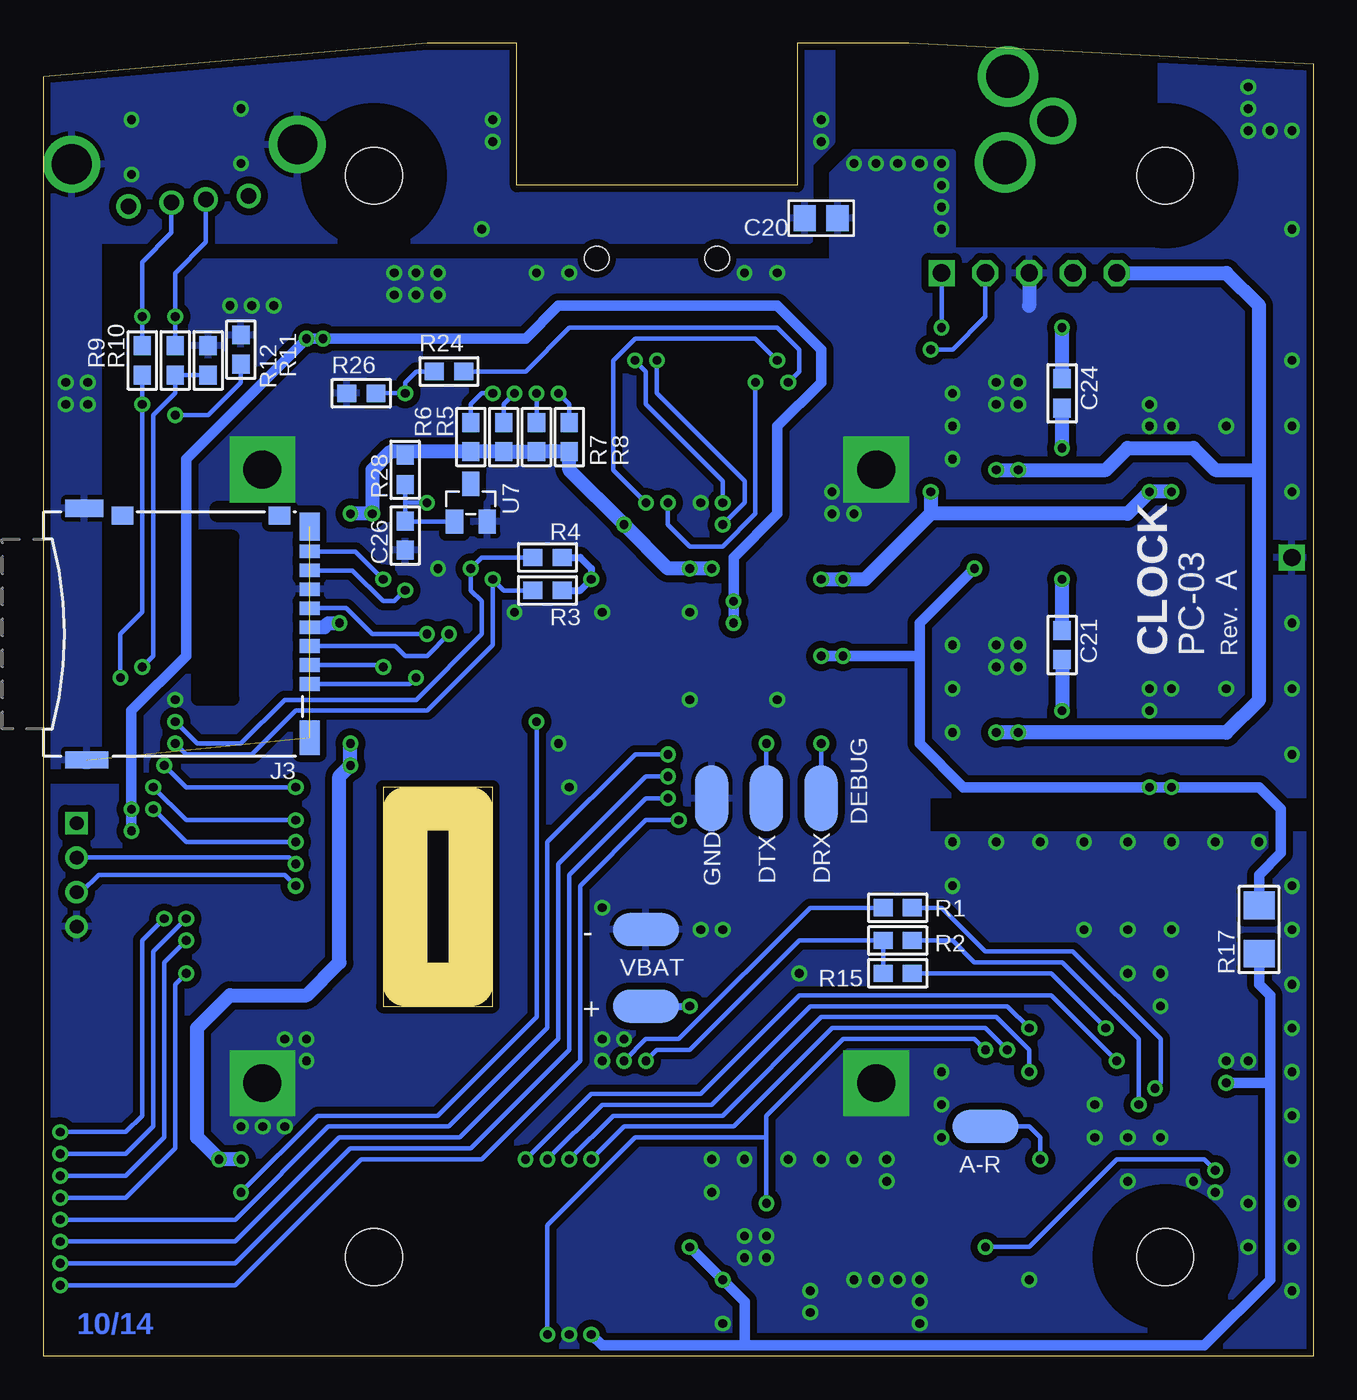
[diagram p5: board, bottom side, seen from below]

Size 73.66 x 76.2 mm. Coordinates in mm from the lower left corner, seen from the top.
Outline: 0,0 73.66,0 73.66,74.24 51.44,76.2 46.23,76.2 46.23,67.94 29.97,67.94 29.97,76.2 23.5,76.2 0,74.98 0,0
Copper layers (1*16): Top 0.035mm / dielectric 1.5mm / Bottom 0.035mm
Design rules: minimum track width 8mil, minimum drill 18mil, track to track 8mil, track to pad 8mil, pad to pad 8mil, via to via 8mil, smd to smd 6mil, copper to edge 15mil, drill to drill 8mil, minimum pad ring 10mil, minimum via ring 8mil, stop-mask expansion 4mil, vias tented up to drill 24mil, thermal gap 10mil
Holes 3.28 mm at 8.61,5.77 54.51,5.77 54.51,68.5 8.61,68.5
tRestrict: area 4.8,2 to 12.4,9.6; area 4.8,64.7 to 12.4,72.3; area 50.7,2 to 58.3,9.6; area 50.7,64.7 to 58.3,72.3
bRestrict: area 4.8,2 to 12.4,9.6; area 4.8,64.7 to 12.4,72.3; area 50.7,64.7 to 58.3,72.3; area 50.7,2 to 58.3,9.6

### Footprints (pad centres in the part's own frame; a part is rotated, then mirrored left to right if it is on the bottom)
SMD_0603 = smd 1.1 x 1: 1 -0.85,0; 2 0.85,0
SMD_0805 = smd 1.3 x 1.5: 1 -0.95,0; 2 0.95,0
CAP_S0805 = smd 1.3 x 1.5: + -0.95,0; - 0.95,0
CAP_S1210 = smd 1.6 x 2.7: + -1.4,0; - 1.4,0
SMD_1206 = smd 1.6 x 1.8: 1 -1.4,0; 2 1.4,0
CAP_S1206 = smd 1.6 x 1.8: + -1.4,0; - 1.4,0
DIODE_DO214-AA = smd 2.032 x 2.184: A -2.286,0; K 2.286,0
SOT143 = smd 1.2 x 1.44: 1 -0.75,-1.1 | smd 1 x 1.44: 2 0.95,-1.1; 3 0.95,1.1; 4 -0.95,1.1
DF3X-4P-2DSA = drill 0.8 square: 1 3,0 | drill 0.8: 2 1,0; 3 -1,0; 4 -3,0
DF13A-20DP-1.25 = smd 0.7 x 1.7: 1 5.625,3; 2 5.625,-3; 3 4.375,3; 4 4.375,-3; 5 3.125,3; 6 3.125,-3; 7 1.875,3; 8 1.875,-3; 9 0.625,3; 10 0.625,-3; 11 -0.625,3; 12 -0.625,-3; 13 -1.875,3; 14 -1.875,-3; 15 -3.125,3; 16 -3.125,-3; 17 -4.375,3; 18 -4.375,-3; 19 -5.625,3; 20 -5.625,-3 | smd 2 x 2.2: A -8.475,0; B 8.475,0
5027020891 = smd 0.8 x 1.16: 1 -2.9,-15.42; 2 -1.8,-15.42; 3 -0.7,-15.42; 4 0.4,-15.42; 5 1.5,-15.42; 6 2.6,-15.42; 7 3.7,-15.42; 8 4.8,-15.42 | smd 1.05 x 1.25: DC 6.885,-13.675; DT 6.885,-4.55 | smd 1 x 2.5: SHDL@3 -7.3,-2.5 | smd 2 x 1.16: SHLD@1 -6.01,-15.42 | smd 1.6 x 1.16: SHLD@2 6.24,-15.42 | smd 1 x 2.2: SHLD@4 7.3,-2.35
HDR_M_1 = drill 1 square: 1 0,0
7498011122R = smd 0.71 x 2.5: P1 -3.57,-21.9; P2 -2.55,-21.9; P3 -1.53,-21.9; P4 -0.51,-21.9; P5 0.51,-21.9; P6 1.53,-21.9; P8 3.57,-21.9; P9 5.61,-21.9; P10 6.63,-21.9; P11 -6.63,-21.9; P12 -5.61,-21.9 | smd 1.4 x 2.54: S1 -8.51,-8.01; S2 8.51,-8.01 | hole 1.4: -3.5,-18.21; 3.5,-18.21
292303-7 = drill 0.9: 1 13,3.5; 2 13,1; 3 13,-1; 4 13,-3.5 | drill 2.3: SHLD@1 10.28,6.57; SHLD@2 10.28,-6.57
DF13A-10DP-1.25 = smd 0.7 x 1.7: 1 2.5,3; 2 2.5,-3; 3 1.25,3; 4 1.25,-3; 5 0,3; 6 0,-3; 7 -1.25,3; 8 -1.25,-3; 9 -2.5,3; 10 -2.5,-3 | smd 2 x 2.2: A -5.35,0; B 5.35,0
CUI-PJ-013C = drill 2.5: 1 11.2,0; 2 6.2,0 | drill 1.8: 3 8.7,-2.7
HDR_M_5 = drill 1 square: 1 0,0 | drill 1 octagon: 2 2.54,0; 3 5.08,0; 4 7.62,0; 5 10.16,0
ACM7060 = smd 2.5 x 1.5: IA -3.25,1.5; IB -3.25,-1.5; OA 3.25,1.5; OB 3.25,-1.5
IND-10X10 = smd 4 x 3.2: 1 -4.246,0; 2 4.246,0
HC49UP = smd 5.334 x 1.93: 1 -4.826,0; 2 4.826,0
WIRE_SMT_150X75 = smd 3.81 x 1.905: 1 0,0
SOIC8 = smd 0.6 x 2.2: 1 -1.905,-2.667; 2 -0.635,-2.667; 3 0.635,-2.667; 4 1.905,-2.667; 5 1.905,2.667; 6 0.635,2.667; 7 -0.635,2.667; 8 -1.905,2.667
ARIA_G25 = smd 3 x 0.8: E1 19.05,14.605; E2 19.05,13.335; E3 19.05,12.065; E4 19.05,10.795; E5 19.05,9.525; E6 19.05,8.255; E7 19.05,6.985; E8 19.05,5.715; E9 19.05,4.445; E10 19.05,3.175; E11 19.05,1.905; E12 19.05,0.635; E13 19.05,-0.635; E14 19.05,-1.905; E15 19.05,-3.175; E16 19.05,-4.445; E17 19.05,-5.715; E18 19.05,-6.985; E19 19.05,-8.255; E20 19.05,-9.525; E21 19.05,-10.795; E22 19.05,-12.065; E23 19.05,-13.335; E24 19.05,-14.605; W1 -19.05,-14.605; W2 -19.05,-13.335; W3 -19.05,-12.065; W4 -19.05,-10.795; W5 -19.05,-9.525; W6 -19.05,-8.255; W7 -19.05,-6.985; W8 -19.05,-5.715; W9 -19.05,-4.445; W10 -19.05,-3.175; W11 -19.05,-1.905; W12 -19.05,-0.635; W13 -19.05,0.635; W14 -19.05,1.905; W15 -19.05,3.175; W16 -19.05,4.445; W17 -19.05,5.715; W18 -19.05,6.985; W19 -19.05,8.255; W20 -19.05,9.525; W21 -19.05,10.795; W22 -19.05,12.065; W23 -19.05,13.335; W24 -19.05,14.605 | drill 2.2 pad 3.81 square: GND@1 -17.8,17.8; GND@2 17.8,17.8; GND@3 17.8,-17.8; GND@4 -17.8,-17.8 | smd 0.8 x 3: N1 -14.605,19.05; N2 -13.335,19.05; N3 -12.065,19.05; N4 -10.795,19.05; N5 -9.525,19.05; N6 -8.255,19.05; N7 -6.985,19.05; N8 -5.715,19.05; N9 -4.445,19.05; N10 -3.175,19.05; N11 -1.905,19.05; N12 -0.635,19.05; N13 0.635,19.05; N14 1.905,19.05; N15 3.175,19.05; N16 4.445,19.05; N17 5.715,19.05; N18 6.985,19.05; N19 8.255,19.05; N20 9.525,19.05; N21 10.795,19.05; N22 12.065,19.05; N23 13.335,19.05; N24 14.605,19.05; S1 14.605,-19.05; S2 13.335,-19.05; S3 12.065,-19.05; S4 10.795,-19.05; S5 9.525,-19.05; S6 8.255,-19.05; S7 6.985,-19.05; S8 5.715,-19.05; S9 4.445,-19.05; S10 3.175,-19.05; S11 1.905,-19.05; S12 0.635,-19.05; S13 -0.635,-19.05; S14 -1.905,-19.05; S15 -3.175,-19.05; S16 -4.445,-19.05; S17 -5.715,-19.05; S18 -6.985,-19.05; S19 -8.255,-19.05; S20 -9.525,-19.05; S21 -10.795,-19.05; S22 -12.065,-19.05; S23 -13.335,-19.05; S24 -14.605,-19.05
SSOP28 = smd 0.34 x 1.6: 1 -4.225,-3.85; 2 -3.575,-3.85; 3 -2.925,-3.85; 4 -2.275,-3.85; 5 -1.625,-3.85; 6 -0.975,-3.85; 7 -0.325,-3.85; 8 0.325,-3.85; 9 0.975,-3.85; 10 1.625,-3.85; 11 2.275,-3.85; 12 2.925,-3.85; 13 3.575,-3.85; 14 4.225,-3.85; 15 4.225,3.85; 16 3.575,3.85; 17 2.925,3.85; 18 2.275,3.85; 19 1.625,3.85; 20 0.975,3.85; 21 0.325,3.85; 22 -0.325,3.85; 23 -0.975,3.85; 24 -1.625,3.85; 25 -2.275,3.85; 26 -2.925,3.85; 27 -3.575,3.85; 28 -4.225,3.85
PPSOP8 = smd 0.4 x 1.6: 1 -0.975,-2.2; 2 -0.325,-2.2; 3 0.325,-2.2; 4 0.975,-2.2; 5 0.975,2.2; 6 0.325,2.2; 7 -0.325,2.2; 8 -0.975,2.2 | smd 1.89 x 1.57: T 0,0
SOIC8-EP = smd 0.6 x 2.2: 1 -1.905,-2.667; 2 -0.635,-2.667; 3 0.635,-2.667; 4 1.905,-2.667; 5 1.905,2.667; 6 0.635,2.667; 7 -0.635,2.667; 8 -1.905,2.667 | smd 2.4 x 2.1: EP 0,0
SOT23 = smd 1 x 1.4: 1 -0.95,-1.1; 2 0.95,-1.1; 3 0,1.1

### Placement (x,y rotation side)
C1  59.05,62.23 0 top
C2  59.05,64.14 0 top
C3  64.14,63.5 90 top
C4  6.35,23.5 180 top
C5  15.24,23.5 0 top
C6  18.41,13.97 0 top
C7  19.05,15.88 0 top
C8  18.41,12.06 0 top
C9  30.48,2.54 270 top
C10  32.38,2.54 270 top
C11  3.81,12.7 180 top
C12  3.81,18.41 180 top
C13  19.05,3.17 270 top
C14  22.86,6.35 180 top
C15  19.05,48.9 180 top
C16  19.68,9.53 90 top
C17  24.13,1.91 90 top
C18  15.88,66.04 180 top
C19  27.94,62.23 90 top
C20  28.57,66.04 180 bottom
C21  14.61,41.27 90 bottom
C22  19.05,33.66 180 top
C23  13.34,34.92 0 top
C24  14.61,55.88 90 bottom
C25  13.34,50.16 0 top
C26  52.7,47.62 270 bottom
C27  5.08,46.35 180 top
C28  4.45,62.87 180 top
C29  3.81,14.61 180 top
C30  13.34,32.38 0 top
C31  13.34,47.62 0 top
C32  38.73,10.79 0 top
C33  38.73,1.91 0 top
D1  12.7,41.27 90 top
D2  12.7,56.52 90 top
DA1  67.31,62.87 270 top
F1  24.77,62.23 270 top
J1  71.75,27.94 90 top
J2  67.94,10.16 90 top
J3  73.66,41.91 90 bottom
J4  1.27,46.35 0 top
J5  38.1,81.92 0 top
J6  66.4,79.98 265 top
J7  43.81,6.35 0 top
J8  17.53,80.47 272 top
J9  21.59,62.87 180 top
L1  62.87,59.05 0 top
L2  62.23,63.5 90 top
L3  24.77,69.85 270 top
L4  5.08,38.73 270 top
L5  5.08,53.98 270 top
L6  36.2,2.54 270 top
L7  36.2,10.16 90 top
Q1  10.79,27.3 0 top
R1  24.13,26.04 0 bottom
R2  24.13,24.13 0 bottom
R3  44.45,44.45 180 bottom
R4  44.45,46.35 180 bottom
R5  46.99,53.34 270 bottom
R6  48.9,53.34 270 bottom
R7  45.09,53.34 270 bottom
R8  43.18,53.34 270 bottom
R9  67.94,57.78 90 bottom
R10  66.04,57.78 90 bottom
R11  62.23,58.42 270 bottom
R12  64.14,57.78 270 bottom
R13  10.79,23.5 0 top
R14  3.81,20.95 0 top
R15  24.13,22.23 0 bottom
R16  67.94,41.91 180 top
R17  3.17,24.77 270 bottom
R18  26.04,6.99 270 top
R19  21.59,1.91 90 top
R20  26.04,1.91 90 top
R21  22.86,8.26 180 top
R22  8.89,46.35 270 top
R23  8.26,61.59 270 top
R24  50.16,57.15 0 bottom
R26  55.24,55.88 0 bottom
R28  52.7,51.44 90 bottom
R29  27.94,6.99 270 top
R30  27.94,1.91 90 top
TP1  38.73,20.32 180 bottom
TP2  38.73,24.77 180 bottom
U1  52.07,58.42 270 top
U2  43.18,33.66 270 top
U3  10.79,16.51 270 top
U4  32.38,6.35 270 top
U5  17.78,40.64 0 top
U6  17.78,55.88 0 top
U7  48.9,49.53 0 bottom
U8  68.58,45.72 0 top
U$1  [OPENHW_LOGO_200]  15.11,7.49 0 top
U$2  [INFO_DATE]  71.75,1.27 0 bottom
U$3  [INFO_COMPACT]  6.99,45.72 90 bottom
U$4  [LOGO2]  2.41,67.94 0 top
U$6  [INFO_AUTHOR]  14.15,2.67 90 top
W1  19.05,13.34 0 bottom
W2  28.57,32.38 90 bottom
W3  31.75,32.38 90 bottom
W4  34.92,32.38 270 bottom

### Tracks (layer width: path | path; a pad name or v marks a point on that pad's centre or on a via)
3.3V  (via drill 0.51)
  Top 0.406: U8.4 66.21,46.82 64.77,48.26 U2.N1 | v41.91,45.09 41.91,46.35 v40.01,48.26
  Top 0.61: v22.23,50.16 22.23,56.52 20.19,58.55 U6.5
  Top 0.813: v55.88,48.9 v54.61,48.9 | 28.57,19.05 32.38,22.86 42.55,22.86 45.09,25.4 45.09,33.66 46.99,35.56 v55.88,35.56 | 28.57,19.05 U2.E24 | U2.S1 28.57,19.05 | v36.2,45.72 v34.92,45.72 33.66,45.72 33.02,45.09 v28.57,45.09 v27.3,45.09 | v55.88,35.56 56.52,36.2 v56.52,42.55 56.52,45.72 55.88,46.35 v55.88,48.9 | v55.88,35.56 v55.88,34.29 | 57.78,48.9 U2.W24 | v55.88,48.9 57.78,48.9 | U2.N1 58.42,48.26 57.78,48.9
  Bottom 0.406: R3.1 42.55,44.45 v41.91,45.09 41.91,45.72 42.55,46.35 R4.1
  Bottom 0.813: 52.7,52.49 R6.2 R5.2 R7.2 R8.2 43.18,51.44 v40.01,48.26 37.47,45.72 v36.2,45.72 v34.92,45.72 | 52.7,52.49 53.55,52.49 54.61,51.44 v54.61,48.9 v55.88,48.9 | J3.4 57.38,42.31 57.15,42.55 v56.52,42.55 | R28.2 52.7,52.49 | v8.26,50.16 v9.53,50.16 10.79,48.9 22.23,48.9 | v22.23,50.16 22.23,48.9 | 22.23,48.9 26.04,45.09 v27.3,45.09 v28.57,45.09 | v62.23,11.43 v63.5,11.43 64.77,12.7 64.77,19.05 62.87,20.95 58.42,20.95 56.52,22.86 56.52,33.66 v55.88,34.29 v55.88,35.56
  pour Top (isolate 0.406): 2.54,47.62 2.54,52.7 7.62,52.7 8.89,51.44 12.7,51.44 12.7,47.62
  pour Top (isolate 0.406): 61.91,12.06 65.41,12.06 65.41,10.48 61.91,10.48
5V  (via drill 0.51)
  Top 0.61: v58.42,59.05 v57.47,59.05 U1.7 | U5.5 v19.68,45.72 | v27.3,40.64 v28.57,40.64 31.75,40.64 v33.66,42.55 v33.66,43.81 | v68.58,31.75 v68.58,30.48 68.58,25.4 72.39,21.59 72.39,15.79 | 72.39,15.79 72.39,14.54 J2.4 | J2.2 72.39,15.79
  Bottom 0.61: 22.86,40.64 22.86,35.56 20.32,33.02 v9.53,33.02 v8.26,33.02 3.17,33.02 1.91,31.75 1.91,29.21 3.17,27.94 R17.1 | 22.86,40.64 22.86,42.55 v19.68,45.72 | v33.66,42.55 v33.66,43.81 33.66,46.35 31.11,48.9 31.11,53.98 28.57,56.52 28.57,58.42 31.11,60.96 43.81,60.96 45.72,59.05 v57.47,59.05 v58.42,59.05 65.41,52.07 65.41,40.64 68.58,37.47 v68.58,31.75 v68.58,30.48 | v28.57,40.64 v27.3,40.64 22.86,40.64
  pour Top (isolate 0.406): 2.54,37.47 7.62,37.47 8.89,36.2 12.7,36.2 12.7,31.75 2.54,31.75
5V_AUD  (via drill 0.51)
  Top 0.406: v34.29,4.45 33.34,3.49 C10.+ 30.48,3.49 C9.1 | U4.6 35.87,6.03 v36.2,6.35
  Top 0.61: J7.8 42.56,1.93 v41.91,1.27
  Bottom 0.61: R17.2 3.17,21.59 2.54,20.95 2.54,15.88 | 2.54,15.88 2.54,4.45 6.35,0.64 33.02,0.64 | 33.02,0.64 41.27,0.64 v41.91,1.27 | 2.54,15.88 v5.08,15.88 | v36.2,6.35 v34.29,4.45 33.02,3.17 33.02,0.64
  pour Top (isolate 0.305): 3.81,16.19 5.71,16.19 5.71,15.24 6.35,15.24 6.35,14.29 4.45,14.29 4.45,15.56 3.81,15.56
AD0  (via drill 0.51)
  Top 0.254: U2.W20 v52.7,55.88
  Bottom 0.254: R26.2 v52.7,55.88 52.7,56.52 52.07,57.15 R24.1
AD1  (via drill 0.51)
  Top 0.254: U2.W21 53.98,50.16 53.34,49.53 53.34,46.99 55.24,45.09 55.24,39.37 52.7,36.83 v45.09,36.83 | v62.23,9.53 64.94,9.53 J2.11
  Bottom 0.254: v45.09,36.83 45.09,19.68 50.8,13.97 57.78,13.97 v62.23,9.53
DAC_SHDN  (via drill 0.51)
  Top 0.254: U4.1 30.18,8.6 30.48,8.89 v31.75,8.89 | U3.27 16.75,20.09 v19.05,17.78 | J7.4 45.06,1.89 v44.45,1.27
  Bottom 0.254: v19.05,17.78 19.68,18.41 27.3,18.41 31.75,13.97 31.75,12.7 | 31.75,12.7 39.37,12.7 44.45,7.62 v44.45,1.27 | v31.75,8.89 31.75,12.7
DAC_VDD  (via drill 0.51)
  Top 0.254: U3.4 6.08,18.79 5.71,18.41 C12.1 4.66,19.47 4.45,19.68 3.17,19.68 2.96,19.9 R14.1
  Bottom 0.254: v12.06,19.05 15.24,22.23 R15.2
  pour Top (isolate 0.305, rank 2): 6.99,15.88 6.99,19.05 11.43,19.05 12.06,19.68 14.61,19.68 14.61,15.88
DOUT  (via drill 0.51)
  Top 0.254: U3.5 10.44,18.14 v11.43,17.14 | J7.1 46.31,10.84 v45.72,11.43
  Bottom 0.254: v11.43,17.14 15.24,20.95 29.84,20.95 35.56,15.24 41.91,15.24 v45.72,11.43
DRX  (via drill 0.51)
  Top 0.254: U2.S14 v28.57,35.56
  Bottom 0.254: v28.57,35.56 W2.1
DTX  (via drill 0.51)
  Top 0.254: U2.S13 30.48,34.29 v31.75,35.56
  Bottom 0.254: v31.75,35.56 W3.1
EARTH  (via drill 0.51)  (2 unrouted)
  Top 0.406: J5.S1 28.57,73.91 v28.57,71.75 | J5.S2 47.62,73.91 v47.62,70.48
  other vias: 71.12,56.52 72.39,56.52 72.39,55.24 71.12,55.24 68.58,68.58 68.58,71.75 62.23,72.39 62.23,69.22 47.62,71.75 28.57,70.48 48.26,65.41
  pour Top (isolate 0.406): 46.99,64.77 46.99,76.2 73.66,76.2 73.66,53.98 70.48,53.98 70.48,64.77
  pour Bottom (isolate 0.406): 29.21,64.77 29.21,69.22 27.94,70.48 27.94,76.2 29.84,76.2 29.84,67.94 46.35,67.94 46.35,76.2 73.66,76.2 73.66,34.29 70.48,34.29 70.48,64.77
  pour Top: 27.94,70.48 27.94,76.2 29.84,76.2 29.84,69.85 29.84,69.22 29.21,69.22
ETH_3V3
  Top 0.254: 38.61,62.1 38.73,62.23
  Top 0.406: J5.P2 35.55,61.59 36.2,62.23 38.73,62.23 40.01,62.23 40.64,61.59 40.64,57.15 40.01,56.52 36.2,56.52 34.92,55.24 U2.W6 | J5.P5 38.61,62.1
ETH_LINK  (via drill 0.51)
  Top 0.254: U2.W8 v37.47,49.53 | v32.38,56.52 32.38,57.78 31.47,58.7 J5.P11
  Bottom 0.254: v37.47,49.53 37.47,48.26 36.2,46.99 34.29,46.99 32.38,48.9 v32.38,56.52
ETH_RX+  (via drill 0.51)
  Top 0.254: J5.P4 37.59,58.3 v38.1,57.78 | U2.W2 29.84,50.16 31.75,48.26 v34.29,48.26
  Bottom 0.254: v38.1,57.78 38.1,55.88 33.02,50.8 33.02,49.53 v34.29,48.26
ETH_RX-  (via drill 0.51)
  Top 0.254: J5.P6 39.63,58.05 v39.37,57.78 | U2.W3 31.11,50.16 31.75,49.53 v34.29,49.53
  Bottom 0.254: v39.37,57.78 38.73,57.15 38.73,55.24 34.29,50.8 v34.29,49.53
ETH_TRF
  Top 0.254: U2.W7 36.2,55.24 36.83,55.88 41.27,55.88 43.71,58.31 J5.P9
ETH_TX+
  Top 0.254: J5.P1 34.53,57.39 32.38,55.24 U2.W4
ETH_TX-
  Top 0.254: J5.P3 36.57,58.16 33.66,55.24 U2.W5
GND  (via drill 0.51)
  Top 0.406: U4.7 32.38,6.67 U4.T | J7.6 43.81,1.91 v43.18,1.27 | U8.1 66.21,44.62 65.41,43.81 65.41,38.73 v66.04,38.1
  Top 0.61: U6.7 v17.14,56.52 | U5.7 v17.14,41.27
  Top 0.813: L3.OA 26.27,64.54 27.3,63.5
  Bottom 0.813: J9.3 16.51,60.96
  other vias: 45.09,62.87 62.87,60.96 53.34,61.59 61.59,60.96 31.11,62.87 50.8,61.59 60.33,60.96 28.57,11.43 1.27,6.35 1.27,71.12 2.54,71.12 3.81,71.12 43.18,62.87 33.02,62.87 24.13,69.22 25.4,69.22 3.81,72.39 3.81,73.66 22.86,69.22 26.67,69.22 1.27,24.77 33.02,11.43 1.27,16.51 1.27,19.05 26.67,11.43 13.34,29.84 1.27,21.59 21.59,16.51 10.79,29.84 8.26,29.84 3.81,17.14 1.27,27.3 5.71,29.84 3.17,29.84 30.48,11.43 5.08,17.14 12.7,12.7 12.7,14.61 10.79,10.16 1.27,13.97 1.27,11.43 1.27,8.89 1.27,3.81 21.59,14.61 24.77,10.16 3.81,8.89 3.81,6.35 5.71,9.53 8.89,20.32 10.79,22.23 24.13,4.45 25.4,4.45 26.67,4.45 22.86,4.45 22.86,3.17 22.86,1.91 6.99,10.16 8.89,12.7 16.51,4.45 29.21,3.81 31.75,6.99 33.02,6.99 33.02,5.71 31.75,5.71 21.59,69.22 10.79,24.77 8.26,24.77 15.88,29.84 18.41,29.84 20.95,29.84 21.59,12.7 1.27,34.92 1.27,38.73 1.27,42.55 1.27,50.16 1.27,53.98 1.27,57.78 1.27,65.41 5.08,38.73 8.26,38.73 5.08,53.98 8.26,53.98 18.41,56.52 18.41,55.24 17.14,55.24 18.41,41.27 17.14,40.01 18.41,40.01 21.59,67.94 21.59,66.67 21.59,65.41 20.95,36.2 20.95,38.73 20.95,41.27 20.95,52.07 20.95,53.98 20.95,55.88 34.29,1.91 29.21,2.54 34.92,9.53 34.92,11.43 8.89,22.23 10.79,12.7 62.23,13.34 60.96,13.34 40.01,18.41 41.27,18.41 50.8,62.87 53.34,62.87 52.07,62.87 52.07,61.59 36.2,43.18 59.69,13.34 58.42,17.14 59.69,18.41 26.67,48.9 41.27,17.14 43.81,35.56 43.18,33.02 29.84,22.23 34.29,24.77 41.27,26.04 27.94,48.9 41.27,43.18 46.35,43.18 50.8,45.72 36.2,38.1 27.94,50.16 35.56,49.53 58.42,18.41 9.53,38.73 9.53,37.47 9.53,53.98 9.53,55.24 24.77,11.43 31.11,38.1 35.56,24.77 20.95,27.3 13.34,24.77
  pour Bottom (isolate 0.406): 73.66,0 0,0 0,76.2 8.89,76.2 8.89,64.14 20.95,64.14 20.95,69.85 26.67,69.85 27.94,68.58 27.94,63.5 68.58,63.5 68.58,33.02 73.66,33.02
  pour Top (isolate 0.406): 29.84,57.15 29.84,63.5 64.14,63.5 64.14,57.15
  pour Top (isolate 0.305, rank 6): 21.59,30.48 21.59,17.14 22.23,17.14 22.23,12.06 41.27,12.06 41.27,0 0.64,0 0.64,30.48
  pour Top (isolate 0.406, rank 6): 0,31.75 21.59,31.75 21.59,54.61 27.94,54.61 27.94,68.58 26.67,69.85 20.95,69.85 20.95,64.14 8.89,64.14 8.89,76.2 0,76.2
  pour Top (isolate 0.406, rank 6): 23.5,13.97 23.5,53.34 62.87,53.34 62.87,17.78 64.77,17.78 64.77,12.7 59.05,12.7 59.05,13.97
HID0  (via drill 0.51)
  Top 0.254: U3.22 16.18,16.84 v16.51,16.51 | J7.5 43.81,10.79 v43.18,11.43
  Bottom 0.254: v16.51,16.51 16.51,17.78 18.41,19.68 28.57,19.68 34.29,13.97 40.64,13.97 v43.18,11.43
HID1  (via drill 0.51)
  Top 0.254: U3.23 17.48,17.48 v17.78,17.78 | J7.7 42.56,10.78 v41.91,11.43
  Bottom 0.254: v17.78,17.78 19.05,19.05 27.94,19.05 33.66,13.34 40.01,13.34 v41.91,11.43
HID2  (via drill 0.51)
  Top 0.254: U3.24 15.6,18.14 v16.51,19.05 | J7.3 45.06,10.81 v44.45,11.43
  Bottom 0.254: v16.51,19.05 17.78,20.32 29.21,20.32 34.92,14.61 41.27,14.61 v44.45,11.43
IN_GND
  pour Top (isolate 0.406): 12.06,76.2 26.67,76.2 26.67,71.75 19.68,71.75 19.68,66.04 12.06,66.04
MISO  (via drill 0.51)
  Top 0.254: U2.S9 27.3,29.21 27.94,29.84 35.56,29.84 v36.83,31.11 | v72.71,4.13 72.3,4.54 J2.20
  Bottom 0.254: v36.83,31.11 38.73,31.11 42.55,27.3 42.55,17.14 48.26,11.43 55.24,11.43 62.55,4.13 v72.71,4.13
MOSI  (via drill 0.51)
  Top 0.254: U2.S10 34.92,30.48 36.83,32.38 v37.47,32.38 | v72.71,5.4 72.32,5.79 J2.18
  Bottom 0.254: v37.47,32.38 38.73,32.38 43.18,27.94 43.18,17.78 48.9,12.06 55.88,12.06 62.55,5.4 v72.71,5.4
N$1  (via drill 0.51)
  Top 0.406: U2.E20 33.66,19.05 34.92,20.32 v36.2,20.32
  Bottom 0.406: TP1.1 v36.2,20.32
N$2
  Top 0.61: R22.1 7.93,47.3 6.99,46.35 C27.1
N$3
  Top 0.813: R23.1 7.3,62.55 6.99,62.87 C28.1
N$4
  Top 0.813: L3.IB 21.74,73.1 J8.1 17.27,68.63 C18.1
N$5
  Top 0.61: C3.1 64.14,59.05 | 64.14,59.05 L1.2 | 64.14,59.05 69.85,59.05 70.48,59.69 70.48,62.87 69.53,63.81 DA1.4 68.41,65.23 68.75,65.57 J6.1
N$6
  Top 0.61: DA1.1 65.47,64.35 C3.2 62.65,64.35 62.55,64.45 L2.2 62.23,66.04 61.78,66.49 J6.4
N$7  (via drill 0.51)
  Top 0.254: DA1.3 68.41,60.79 v67.94,60.33
  Bottom 0.254: R9.2 v67.94,60.33 67.94,63.5 66.26,65.19 J6.2
N$8  (via drill 0.51)
  Top 0.254: v66.04,60.33 66.04,60.96 66.21,61.13 DA1.2
  Bottom 0.254: R10.2 v66.04,60.33 66.04,62.87 64.27,64.64 J6.3
N$10
  cutout Bottom: 0,32.38 22.23,32.38 22.23,30.48 0,30.48
N$11  (via drill 0.51)
  Top 0.813: U5.1 15.11,37.97 v14.61,37.47
  Bottom 0.813: C21.1 v14.61,37.47
N$12  (via drill 0.51)
  Top 0.254: U3.9 7.96,15.54 8.89,14.61 v10.16,14.61
  Bottom 0.254: v10.16,14.61 10.16,18.41 14.61,22.86 19.68,22.86 20.95,24.13 R2.2
N$13  (via drill 0.51)
  Top 0.254: U3.8 8.58,16.18 v9.21,15.55
  Bottom 0.254: v9.21,15.55 8.89,15.88 8.89,18.41 13.97,23.5 19.05,23.5 21.59,26.04 R1.2
N$14
  Top 0.254: U3.13 5.95,12.94 5.71,12.7 C11.1
N$15
  Top 0.254: U3.18 16.25,14.23 16.51,13.97 C6.+
N$16
  Top 0.254: U3.20 16.8,15.54 17.14,15.88 C7.1
N$17
  Top 0.254: U3.16 16.27,12.94 17.14,12.06 C8.1
N$18
  Top 0.254: C14.+ 24.13,6.35 25.61,7.83 R18.1 R29.1
N$19
  Top 0.254: U3.3 5.96,19.43 5.71,19.68 5.71,20.32 5.08,20.95 R14.2
N$20  (via drill 0.51)
  Top 0.254: U3.15 15.65,12.29 15.88,12.06 v15.88,11.43
  Bottom 0.254: v15.88,11.43 15.88,12.7 16.51,13.34 W1.1
N$21
  Top 0.254: R16.1 68.8,42.76 69.53,43.49 U8.2
N$24
  Top 0.406: L6.1 36.2,5.08 35.9,5.38 U4.5
N$25
  Top 0.406: L7.1 36.2,7.62 35.9,7.33 U4.8
N$26
  Top 0.254: R18.2 R29.2 27.94,6.03 U4.3
N$27
  Top 0.254: R20.2 R30.2 27.94,4.45 28.87,5.38 U4.4
N$28
  Top 0.254: C17.1 R20.1 R30.1
N$29
  Top 0.254: C14.- 21.91,4.76 21.59,4.45 R19.2 20.54,2.75 19.55,1.77 C13.-
N$31
  Top 0.254: C16.2 20.74,10.38 22.01,9.11 R21.2
N$32
  Top 0.813: L3.OB 23.27,65.64 24.77,64.14 F1.1
N$36  (via drill 0.51)
  Top 0.813: U6.1 15.11,53.21 v14.61,52.7
  Bottom 0.813: v14.61,52.7 C24.1
NRST  (via drill 0.51)
  Top 0.254: U2.E21 32.38,19.68 34.29,21.59 43.81,21.59 46.35,24.13 46.35,33.02 47.62,34.29 54.61,34.29 55.88,33.02 v59.05,33.02 | v66.67,34.29 67.09,34.71 R16.2
  Bottom 0.254: v59.05,33.02 65.41,33.02 v66.67,34.29
PC18/PWM0  (via drill 0.51)
  Top 0.254: J2.10 72.4,10.79 v72.71,10.48 | U2.N20 v65.41,24.13
  Bottom 0.254: v65.41,24.13 66.67,22.86 66.67,12.7 68.9,10.48 v72.71,10.48
PC19/PWM1  (via drill 0.51)
  Top 0.254: v65.41,22.23 64.77,22.86 U2.N21 | J2.12 72.38,9.54 v72.71,9.21
  Bottom 0.254: v65.41,22.23 66.04,21.59 66.04,12.06 68.9,9.21 v72.71,9.21
PC22/TXD3
  Top 0.254: U2.E2 56.52,12.7 57.15,12.06 58.42,12.06 62.2,8.29 J2.13
PC23/RXD3
  Top 0.254: U2.E3 55.24,12.06 55.88,11.43 57.78,11.43 62.18,7.04 J2.15
PC24/RTS3
  Top 0.254: U2.E4 53.98,12.06 55.24,10.79 57.15,10.79 62.16,5.79 J2.17
PC25/CTS3
  Top 0.254: U2.E5 52.7,12.06 54.61,10.16 56.52,10.16 62.14,4.54 J2.19
SCL0  (via drill 0.51)
  Top 0.254: J2.8 72.42,12.04 v72.71,11.75 | U2.W18 50.16,48.26 48.9,46.99 v48.9,45.72 | v65.41,25.4 65.41,30.48 64.77,31.11 64.77,35.56 v66.04,36.83
  Bottom 0.254: v65.41,25.4 67.31,23.5 67.31,13.34 68.9,11.75 v72.71,11.75 | v66.04,36.83 64.77,35.56 62.23,35.56 59.69,38.1 52.07,38.1 48.26,41.91 48.26,43.81 48.9,44.45 v48.9,45.72 48.26,46.35 R4.2
SD_CLK  (via drill 0.51)
  Top 0.254: v51.44,41.91 50.16,40.64 42.55,40.64 40.01,38.1 40.01,30.48 37.47,27.94 29.84,27.94 27.3,25.4 U2.S6
  Bottom 0.254: J3.5 56.11,43.41 54.61,41.91 v51.44,41.91
SD_CMD  (via drill 0.51)
  Top 0.254: v50.16,41.91 49.53,41.27 41.91,41.27 39.37,38.73 39.37,31.11 36.83,28.57 29.21,28.57 27.3,26.67 U2.S7
  Bottom 0.254: v50.16,41.91 51.44,40.64 52.7,40.64 53.27,41.21 J3.3
SD_DAT0  (via drill 0.51)
  Top 0.254: U2.S8 27.3,27.94 28.57,29.21 36.2,29.21 38.73,31.75 38.73,39.37 41.27,41.91 48.9,41.91 51.44,44.45 v52.7,44.45
  Bottom 0.254: J3.7 55.77,45.61 53.98,43.81 53.34,43.81 v52.7,44.45
SD_DAT1  (via drill 0.51)
  Top 0.254: U2.S5 27.3,24.13 30.48,27.3 38.1,27.3 40.64,29.84 40.64,37.47 43.18,40.01 50.8,40.01 53.98,43.18 v53.98,45.09
  Bottom 0.254: J3.8 55.6,46.71 v53.98,45.09
SD_DAT2  (via drill 0.51)
  Top 0.254: U2.S4 27.3,22.86 31.11,26.67 38.73,26.67 41.27,29.21 41.27,36.83 43.18,38.73 51.44,38.73 v52.07,39.37
  Bottom 0.254: J3.1 52.43,39.01 v52.07,39.37
SD_DAT3  (via drill 0.51)
  Top 0.254: U2.S3 27.3,21.59 31.75,26.04 39.37,26.04 41.91,28.57 41.91,36.2 43.81,38.1 52.07,38.1 v53.98,40.01
  Bottom 0.254: v53.98,40.01 54.08,40.11 J3.2
SDA0  (via drill 0.51)
  Top 0.254: J2.6 72.44,13.29 v72.71,13.02 | U2.W17 48.9,48.9 47.62,47.62 v47.62,45.09 | v66.04,35.56 65.41,34.92 65.41,31.75 66.67,30.48 v66.67,25.4
  Bottom 0.254: v66.67,25.4 67.94,24.13 67.94,13.97 68.9,13.02 v72.71,13.02 | v66.04,35.56 65.41,34.92 61.59,34.92 59.05,37.47 51.44,37.47 47.62,41.27 v47.62,45.09 46.99,44.45 R3.2
SPCK  (via drill 0.51)
  Top 0.254: U2.S11 27.3,31.75 27.94,31.11 34.29,31.11 36.83,33.66 v37.47,33.66 | v72.71,6.67 72.34,7.04 J2.16
  Bottom 0.254: v37.47,33.66 38.73,33.66 43.81,28.57 43.81,18.41 49.53,12.7 56.52,12.7 62.55,6.67 v72.71,6.67
SPI_CS0  (via drill 0.51)
  Top 0.254: U2.S12 27.3,33.02 28.57,31.75 33.66,31.75 36.83,34.92 v37.47,34.92 | v72.71,7.94 72.36,8.29 J2.14
  Bottom 0.254: v37.47,34.92 39.37,34.92 44.45,29.84 44.45,19.05 50.16,13.34 57.15,13.34 62.55,7.94 v72.71,7.94
SPK+
  Top 0.406: L6.2 36.62,1.69 36.83,1.91 C33.1 37.88,2.96 38.27,3.35 J7.10
SPK-
  Top 0.406: J7.9 38.27,9.35 37.88,9.74 C32.1 36.83,10.79 36.62,11.01 L7.2
SW_3.3  (via drill 0.51)
  Bottom 0.813: C24.2 v14.61,59.69
  pour Top (isolate 0.406): 2.54,55.24 2.54,60.96 6.35,60.96 6.99,61.59 17.14,61.59 17.14,56.52 8.89,56.52 7.62,55.24
SW_5V  (via drill 0.51)
  Bottom 0.813: C21.2 v14.61,45.09
  pour Top (isolate 0.406): 2.54,40.01 2.54,45.09 6.99,45.09 7.62,45.72 16.51,45.72 17.14,45.09 17.14,41.27 8.89,41.27 7.62,40.01
USB_EN1  (via drill 0.51)
  Top 0.254: U1.1 47.62,60.33 43.81,56.52 v43.81,55.88 U2.W13
  Bottom 0.254: v43.81,55.88 43.18,55.24 R8.1
USB_EN2  (via drill 0.51)
  Top 0.254: U1.4 48.26,56.52 v47.62,55.88 U2.W16
  Bottom 0.254: v47.62,55.88 48.26,55.88 48.9,55.24 R6.1
USB_FLAG1  (via drill 0.51)
  Top 0.254: U1.2 47.62,59.05 45.09,56.52 v45.09,55.88 U2.W14
  Bottom 0.254: v45.09,55.88 R7.1
USB_FLAG2  (via drill 0.51)
  Top 0.254: U1.3 47.62,57.78 46.35,56.52 v46.35,55.88 U2.W15
  Bottom 0.254: v46.35,55.88 46.99,55.24 R5.1
USBA_5V
  Top 0.61: U1.8 59.05,60.33 | 59.05,60.33 60.33,59.05 L1.1 | C2.1 58.2,64.03 C1.1 58.2,61.17 59.05,60.33
USBA_D+  (via drill 0.51)
  Top 0.254: U2.E19 34.92,17.78 37.47,20.32 45.72,20.32 46.35,19.68 54.61,19.68 55.24,20.32 55.24,29.21 57.15,31.11 v59.05,31.11 | v67.94,40.01 67.94,33.66 v67.31,33.02
  Bottom 0.254: v59.05,31.11 65.41,31.11 v67.31,33.02 | v67.94,40.01 67.31,40.64 67.31,54.61 66.04,55.88 R10.1 R12.2
USBA_D-  (via drill 0.51)
  Top 0.254: v59.05,29.84 57.15,29.84 55.88,28.57 55.88,19.68 55.24,19.05 45.72,19.05 45.09,19.68 38.1,19.68 36.2,17.78 U2.E18 | v67.94,55.24 67.31,55.24 66.67,54.61 v66.04,54.61 | v69.22,39.37 69.22,33.66 v67.31,31.75
  Bottom 0.254: v59.05,29.84 65.41,29.84 v67.31,31.75 | R9.1 v67.94,55.24 67.94,43.18 69.22,41.91 v69.22,39.37 | v66.04,54.61 64.14,54.61 62.23,56.52 R11.2
USBB_5V
  Top 0.61: U1.5 62.23,56.52 71.75,46.99 J1.1
USBB_D+  (via drill 0.51)
  Top 0.254: U2.E16 v38.73,17.14
  Bottom 0.254: v38.73,17.14 38.1,17.78 36.2,17.78 29.84,24.13 R2.1 R15.1
USBB_D-  (via drill 0.51)
  Top 0.254: U2.E15 v40.01,17.14
  Bottom 0.254: R1.1 29.21,26.04 36.83,18.41 38.73,18.41 v40.01,17.14
USBC_D+  (via drill 0.51)
  Top 0.254: U2.E12 43.81,16.51 44.45,17.14 55.88,17.14 58.42,19.68 58.42,26.67 v59.05,27.3
  Bottom 0.254: v59.05,27.3 59.69,27.94 70.48,27.94 71.48,26.94 J1.3
USBC_D-  (via drill 0.51)
  Top 0.254: U2.E13 42.55,16.51 43.81,17.78 55.24,17.78 57.78,20.32 57.78,27.94 58.42,28.57 v59.05,28.57
  Bottom 0.254: v59.05,28.57 59.42,28.94 J1.2
V_AUX_MON  (via drill 0.51)
  Top 0.254: v22.23,58.42 24.13,56.52 v30.48,56.52
  Bottom 0.254: J9.2 19.05,60.33 20.95,58.42 v22.23,58.42 | R24.2 45.72,57.15 43.18,59.69 31.11,59.69 29.84,58.42 29.84,57.15 v30.48,56.52
V_AUX_ON  (via drill 0.51)
  Top 0.254: v21.59,59.69 22.86,59.69 24.77,57.78 v31.11,57.78 | U2.W9 v38.73,49.53
  Bottom 0.254: J9.1 v21.59,59.69 | v31.11,57.78 32.38,59.05 39.37,59.05 40.64,57.78 40.64,51.44 v38.73,49.53
V_MAIN
  Top 0.813: J9.4 15.88,60.96 22.23,60.96 22.36,60.83 F1.2 C19.1
VCC  (via drill 0.51)
  Top 0.61: v18.41,36.2 U5.3 U5.2 | v17.14,51.44 U6.2 U6.3 v18.41,51.44 | C22.+ 20.45,34.8
  Top 0.813: v17.14,36.2 v18.41,36.2 19.05,36.2 20.45,34.8 | C15.+ 20.45,50.03 19.05,51.44 v18.41,51.44 v17.14,51.44
  Bottom 0.813: 3.17,51.44 3.17,38.1 5.08,36.2 v17.14,36.2 v18.41,36.2 | 3.17,51.44 3.17,60.96 5.08,62.87 J9.5 | v18.41,51.44 v17.14,51.44 12.06,51.44 10.79,52.7 6.99,52.7 5.71,51.44 3.17,51.44
VOUTL  (via drill 0.51)
  Top 0.254: U3.14 5.93,12.29 5.71,12.06 v5.71,10.79 | C13.+ v19.05,6.35 19.05,6.99 19.68,7.62 C16.1
  Bottom 0.254: v5.71,10.79 6.35,11.43 11.43,11.43 16.51,6.35 v19.05,6.35
VREF  (via drill 0.51)
  Top 0.254: U2.W19 v51.44,49.53
  Bottom 0.254: 52.7,49.53 R28.1 52.7,50.8 | 52.7,49.53 C26.1 52.7,48.43 U7.1 | v51.44,49.53 52.7,49.53
XTI
  Top 0.254: C5.1 14.39,22.44 14.64,22.18 U3.28 | C5.1 14.39,24.55 15.62,25.78 Q1.2 | R13.2 C5.1
XTO
  Top 0.254: C4.1 7.2,22.44 6.95,22.18 U3.1 | C4.1 7.2,24.55 5.97,25.78 Q1.1 | C4.1 R13.1

### Text on the board
tPlace: BFRIGON.COM
bPlace: DRX | DTX | GND
bNames: DEBUG | - | VBAT | + | A-R
_tsilk: J8 | C19 | L3 | C18 | L5 | C2 | C3 | F1 | J6 | C22 | J5 | U1 | L2 | DA1 | C1 | C24 | J10 | C21 | L1 | D1 | C25 | J9 | U2 | U6 | U5 | R27 | W | R25 | R23 | L4 | C23 | R3 | J2 | R4 | A | CLOCK | PC-03 | Rev. | S | N | C9 | C17 | R20 | R30 | C10 | U4 | R18 | R29 | E | R19 | C13 | C14 | R21 | C16 | R16 | J1 | J7 | R17 | R15 | C8 | Q1 | C7 | C6 | U3 | BFRIGON.COM
_bsilk: C20 | R22 | R11 | R12 | R24 | R26 | R10 | R9 | R5 | R6 | R8 | R7 | U7 | R28 | C26 | R1 | R2 | J3 | J4 | DTX | GND | DRX | VBAT | + | - | D+ | D- | C11 | C12 | R14 | C5 | C4 | R13